# EAGLE design SolarPanel 2p2AZ1 (EAGLE 7.6.0)

## Sheet 1 of 6
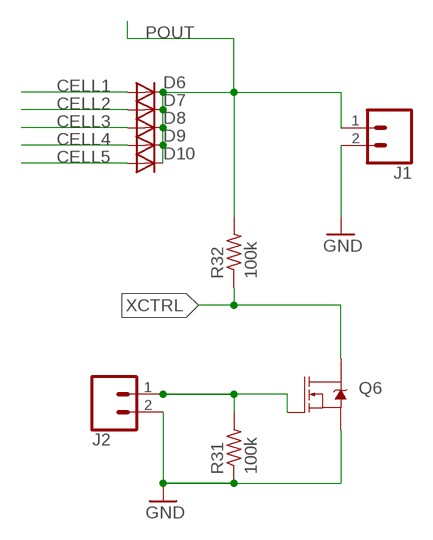
[diagram p0: schematic, sheet 1]

### Parts
D6  DIODE-SOD123  [SOD123]
D7  DIODE-SOD123  [SOD123]
D8  DIODE-SOD123  [SOD123]
D9  DIODE-SOD123  [SOD123]
D10  DIODE-SOD123  [SOD123]
J1  CONN_02  [1X02]
J2  CONN_02  [1X02]
Q6  MOSFET-NCH-BSS138  [SOT23-3]
R31  100k  R-US_R0603  [R0603]
R32  100k  R-US_R0603  [R0603]

### Nets
CELL1: D6.A ; also sheet 2
CELL2: D7.A ; also sheet 3
CELL3: D8.A ; also sheet 4
CELL4: D9.A ; also sheet 5
CELL5: D10.A ; also sheet 6
GND: J1.2 J2.2 Q6.2(S) R31.1 ; also sheet 2,3,4,5,6
N$4: J2.1 Q6.1(G) R31.2
POUT: D6.C D7.C D8.C D9.C D10.C J1.1 R32.2
XCTRL: Q6.3(D) R32.1 ; also sheet 2,3,4,5,6

## Sheet 2 of 6
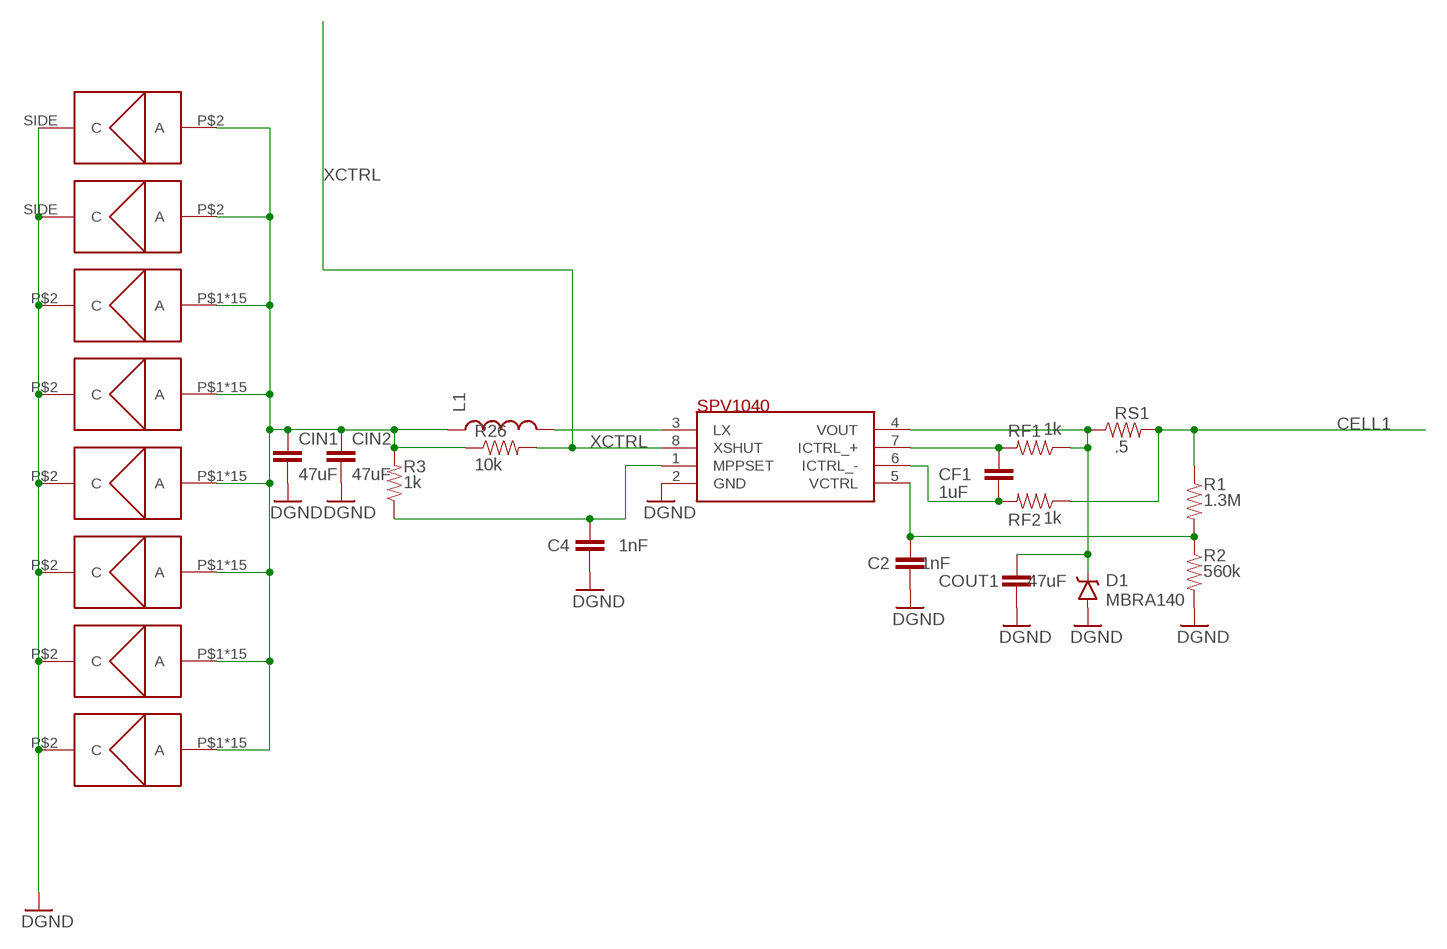
[diagram p1: schematic, sheet 2]

### Parts
C2  1nF  CAP0603-CAP  [0603-CAP]
C4  1nF  CAP0603-CAP  [0603-CAP]
CF1  1uF  CAP0603-CAP  [0603-CAP]
CIN1  47uF  CAP1206  [1206]
CIN2  47uF  CAP1206  [1206]
COUT1  47uF  CAP1206  [1206]
D1  MBRA140  DIODE-SCHOTTKY-MBRA140  [SMA-DIODE]
L1  INDUCTOR1210  [1210]
R1  1.3M  RESISTOR0603-RES  [0603-RES]
R2  560k  RESISTOR0603-RES  [0603-RES]
R3  1k  RESISTOR0603-RES  [0603-RES]
R26  10k  RESISTOR0603-RES  [0603-RES]
RF1  1k  RESISTOR0603-RES  [0603-RES]
RF2  1k  RESISTOR0603-RES  [0603-RES]
RS1  .5  RESISTOR0603-RES  [0603-RES]
U$11  TASC_VIA  [TASC_VIA]
U$12  TASC_VIA  [TASC_VIA]
U$13  TASC_VIA  [TASC_VIA]
U$14  TASC_VIA  [TASC_VIA]
U$15  SPV1040  [TSSOP8]
U$16  TASC_VIA  [TASC_VIA]
U$17  TASC_VIA  [TASC_VIA]
U$18  TASC  [TASC]
U$19  TASC  [TASC]

### Nets
CELL1: R1.1 RF2.1 RS1.2 ; also sheet 1
GND: C2.2 C4.2 CIN1.2 CIN2.2 COUT1.2 D1.A R2.2 U$11.P$2(C) U$12.P$2(C) U$13.P$2(C) U$14.P$2(C) U$15.2(GND) U$16.P$2(C) U$17.P$2(C) U$18.SIDE(C) U$19.SIDE(C) ; supply symbol labelled DGND ; also sheet 1,3,4,5,6
N$3: CIN1.1 CIN2.1 L1.1 R3.2 R26.1 U$11.P$1(A) U$11.P$3(A) U$11.P$4(A) U$11.P$5(A) U$11.P$6(A) U$11.P$7(A) U$11.P$8(A) U$11.P$9(A) U$11.P$10(A) U$11.P$11(A) U$11.P$12(A) U$11.P$13(A) U$11.P$14(A) U$11.P$15(A) U$11.P$16(A) U$12.P$1(A) U$12.P$3(A) U$12.P$4(A) U$12.P$5(A) U$12.P$6(A) U$12.P$7(A) U$12.P$8(A) U$12.P$9(A) U$12.P$10(A) U$12.P$11(A) U$12.P$12(A) U$12.P$13(A) U$12.P$14(A) U$12.P$15(A) U$12.P$16(A) U$13.P$1(A) U$13.P$3(A) U$13.P$4(A) U$13.P$5(A) U$13.P$6(A) U$13.P$7(A) U$13.P$8(A) U$13.P$9(A) U$13.P$10(A) U$13.P$11(A) U$13.P$12(A) U$13.P$13(A) U$13.P$14(A) U$13.P$15(A) U$13.P$16(A) U$14.P$1(A) U$14.P$3(A) U$14.P$4(A) U$14.P$5(A) U$14.P$6(A) U$14.P$7(A) U$14.P$8(A) U$14.P$9(A) U$14.P$10(A) U$14.P$11(A) U$14.P$12(A) U$14.P$13(A) U$14.P$14(A) U$14.P$15(A) U$14.P$16(A) U$16.P$1(A) U$16.P$3(A) U$16.P$4(A) U$16.P$5(A) U$16.P$6(A) U$16.P$7(A) U$16.P$8(A) U$16.P$9(A) U$16.P$10(A) U$16.P$11(A) U$16.P$12(A) U$16.P$13(A) U$16.P$14(A) U$16.P$15(A) U$16.P$16(A) U$17.P$1(A) U$17.P$3(A) U$17.P$4(A) U$17.P$5(A) U$17.P$6(A) U$17.P$7(A) U$17.P$8(A) U$17.P$9(A) U$17.P$10(A) U$17.P$11(A) U$17.P$12(A) U$17.P$13(A) U$17.P$14(A) U$17.P$15(A) U$17.P$16(A) U$18.P$2(A) U$19.P$2(A)
N$11: C2.1 R1.2 R2.1 U$15.5(VCTRL)
N$12: CF1.1 RF1.2 U$15.7(ICTRL_+)
N$13: CF1.2 RF2.2 U$15.6(ICTRL_-)
N$14: COUT1.1 D1.C RF1.1 RS1.1 U$15.4(VOUT)
N$15: L1.2 U$15.3(LX)
N$43: C4.1 R3.1 U$15.1(MPPSET)
XCTRL: R26.2 U$15.8(XSHUT) ; also sheet 1,3,4,5,6

## Sheet 3 of 6
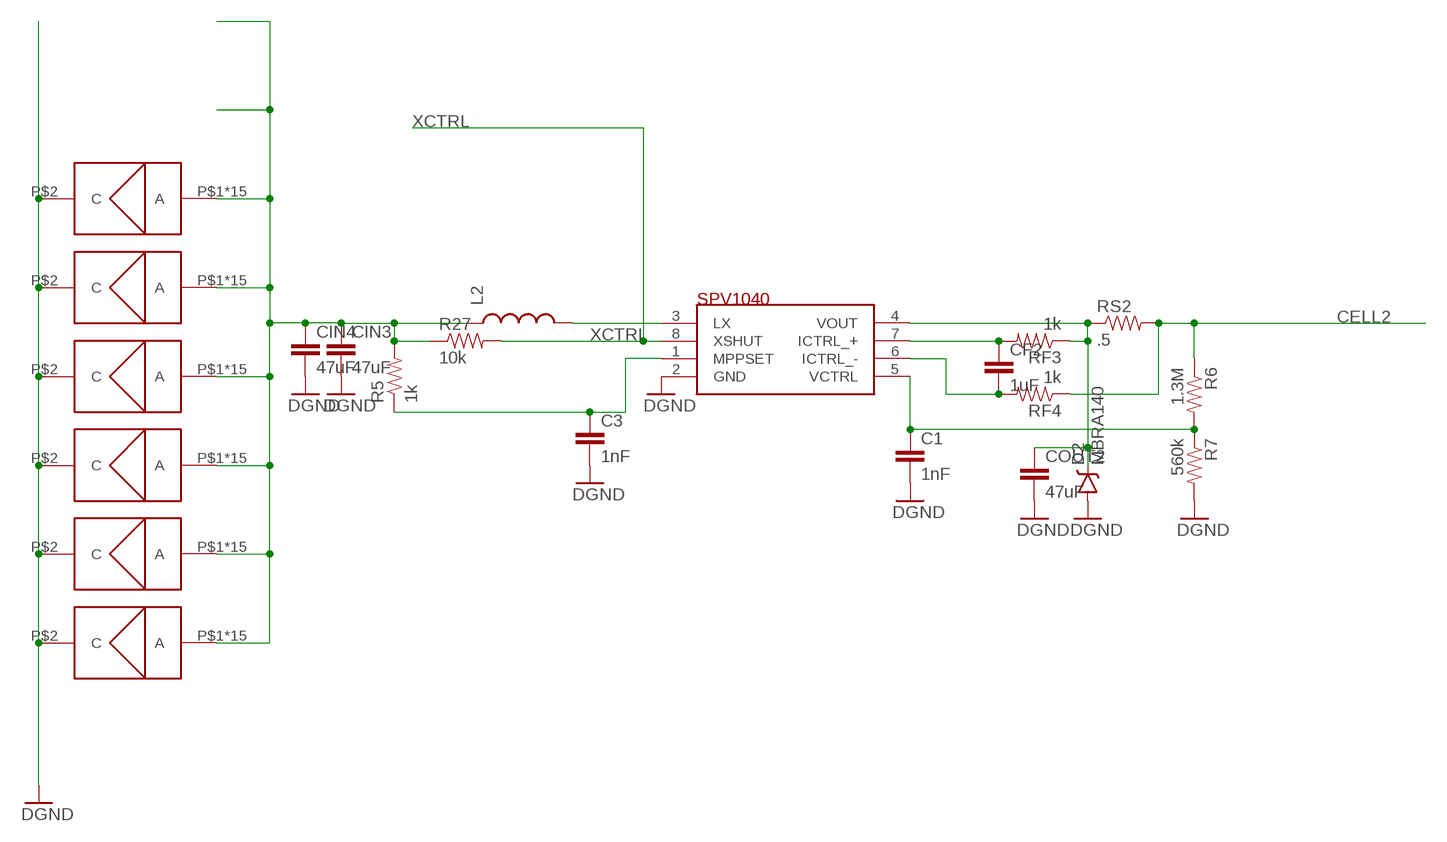
[diagram p2: schematic, sheet 3]

### Parts
C1  1nF  CAP0603-CAP  [0603-CAP]
C3  1nF  CAP0603-CAP  [0603-CAP]
CF2  1uF  CAP0603-CAP  [0603-CAP]
CIN3  47uF  CAP1206  [1206]
CIN4  47uF  CAP1206  [1206]
COUT2  47uF  CAP1206  [1206]
D2  MBRA140  DIODE-SCHOTTKY-MBRA140  [SMA-DIODE]
L2  INDUCTOR1210  [1210]
R5  1k  RESISTOR0603-RES  [0603-RES]
R6  1.3M  RESISTOR0603-RES  [0603-RES]
R7  560k  RESISTOR0603-RES  [0603-RES]
R27  10k  RESISTOR0603-RES  [0603-RES]
RF3  1k  RESISTOR0603-RES  [0603-RES]
RF4  1k  RESISTOR0603-RES  [0603-RES]
RS2  .5  RESISTOR0603-RES  [0603-RES]
U$1  TASC_VIA  [TASC_VIA]
U$2  TASC_VIA  [TASC_VIA]
U$3  TASC_VIA  [TASC_VIA]
U$4  TASC_VIA  [TASC_VIA]
U$5  SPV1040  [TSSOP8]
U$6  TASC_VIA  [TASC_VIA]
U$7  TASC_VIA  [TASC_VIA]

### Nets
CELL2: R6.1 RF4.1 RS2.2 ; also sheet 1
GND: C1.2 C3.2 CIN3.2 CIN4.2 COUT2.2 D2.A R7.2 U$1.P$2(C) U$2.P$2(C) U$3.P$2(C) U$4.P$2(C) U$5.2(GND) U$6.P$2(C) U$7.P$2(C) ; supply symbol labelled DGND ; also sheet 1,2,4,5,6
N$5: CIN3.1 CIN4.1 L2.1 R5.2 R27.1 U$1.P$1(A) U$1.P$3(A) U$1.P$4(A) U$1.P$5(A) U$1.P$6(A) U$1.P$7(A) U$1.P$8(A) U$1.P$9(A) U$1.P$10(A) U$1.P$11(A) U$1.P$12(A) U$1.P$13(A) U$1.P$14(A) U$1.P$15(A) U$1.P$16(A) U$2.P$1(A) U$2.P$3(A) U$2.P$4(A) U$2.P$5(A) U$2.P$6(A) U$2.P$7(A) U$2.P$8(A) U$2.P$9(A) U$2.P$10(A) U$2.P$11(A) U$2.P$12(A) U$2.P$13(A) U$2.P$14(A) U$2.P$15(A) U$2.P$16(A) U$3.P$1(A) U$3.P$3(A) U$3.P$4(A) U$3.P$5(A) U$3.P$6(A) U$3.P$7(A) U$3.P$8(A) U$3.P$9(A) U$3.P$10(A) U$3.P$11(A) U$3.P$12(A) U$3.P$13(A) U$3.P$14(A) U$3.P$15(A) U$3.P$16(A) U$4.P$1(A) U$4.P$3(A) U$4.P$4(A) U$4.P$5(A) U$4.P$6(A) U$4.P$7(A) U$4.P$8(A) U$4.P$9(A) U$4.P$10(A) U$4.P$11(A) U$4.P$12(A) U$4.P$13(A) U$4.P$14(A) U$4.P$15(A) U$4.P$16(A) U$6.P$1(A) U$6.P$3(A) U$6.P$4(A) U$6.P$5(A) U$6.P$6(A) U$6.P$7(A) U$6.P$8(A) U$6.P$9(A) U$6.P$10(A) U$6.P$11(A) U$6.P$12(A) U$6.P$13(A) U$6.P$14(A) U$6.P$15(A) U$6.P$16(A) U$7.P$1(A) U$7.P$3(A) U$7.P$4(A) U$7.P$5(A) U$7.P$6(A) U$7.P$7(A) U$7.P$8(A) U$7.P$9(A) U$7.P$10(A) U$7.P$11(A) U$7.P$12(A) U$7.P$13(A) U$7.P$14(A) U$7.P$15(A) U$7.P$16(A)
N$6: C3.1 R5.1 U$5.1(MPPSET)
N$7: C1.1 R6.2 R7.1 U$5.5(VCTRL)
N$8: CF2.1 RF3.2 U$5.7(ICTRL_+)
N$9: CF2.2 RF4.2 U$5.6(ICTRL_-)
N$10: COUT2.1 D2.C RF3.1 RS2.1 U$5.4(VOUT)
N$16: L2.2 U$5.3(LX)
XCTRL: R27.2 U$5.8(XSHUT) ; also sheet 1,2,4,5,6

## Sheet 4 of 6
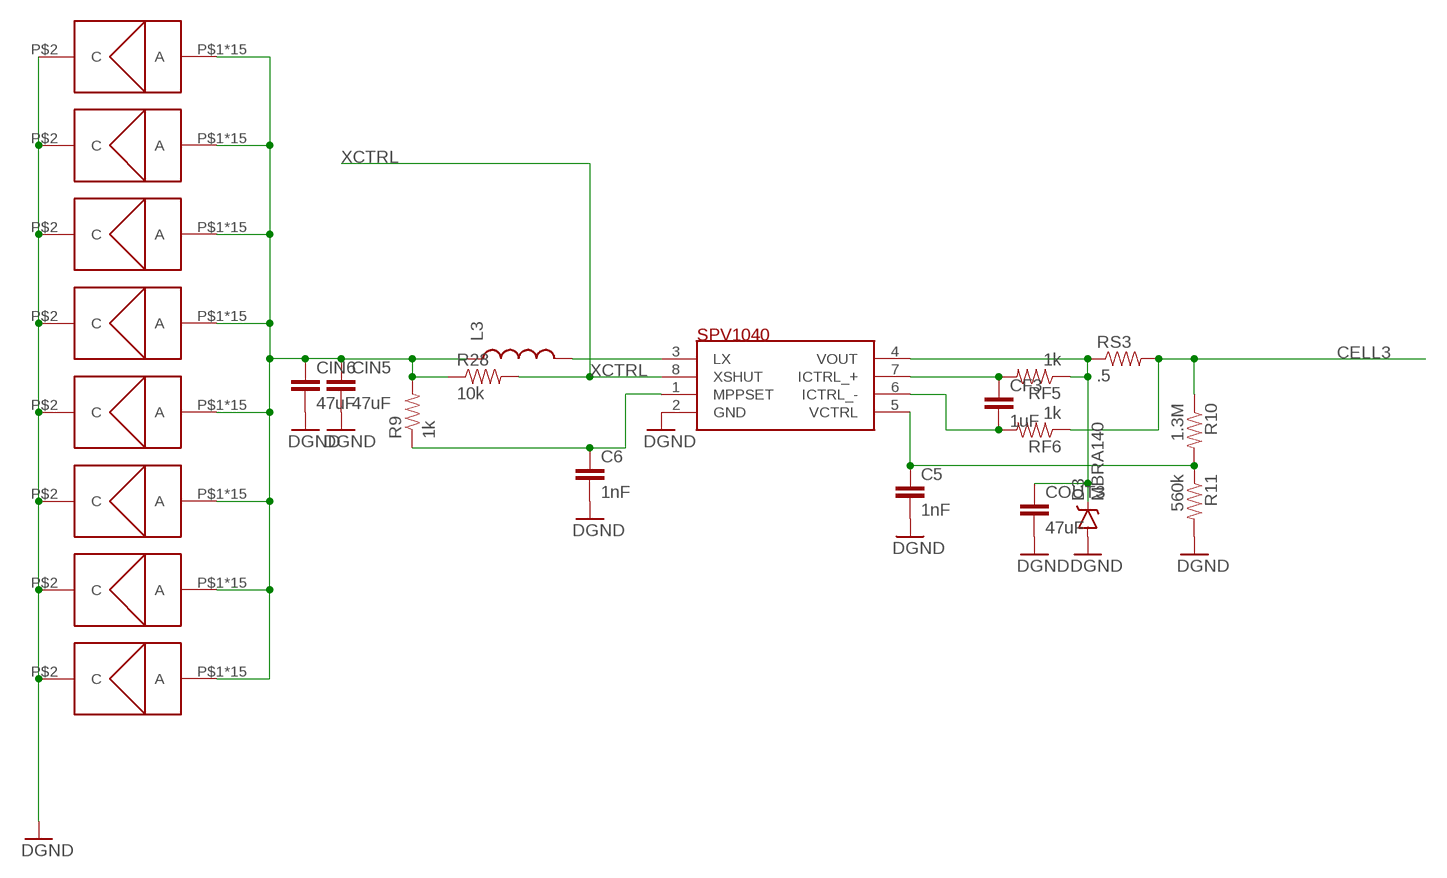
[diagram p3: schematic, sheet 4]

### Parts
C5  1nF  CAP0603-CAP  [0603-CAP]
C6  1nF  CAP0603-CAP  [0603-CAP]
CF3  1uF  CAP0603-CAP  [0603-CAP]
CIN5  47uF  CAP1206  [1206]
CIN6  47uF  CAP1206  [1206]
COUT3  47uF  CAP1206  [1206]
D3  MBRA140  DIODE-SCHOTTKY-MBRA140  [SMA-DIODE]
L3  INDUCTOR1210  [1210]
R9  1k  RESISTOR0603-RES  [0603-RES]
R10  1.3M  RESISTOR0603-RES  [0603-RES]
R11  560k  RESISTOR0603-RES  [0603-RES]
R28  10k  RESISTOR0603-RES  [0603-RES]
RF5  1k  RESISTOR0603-RES  [0603-RES]
RF6  1k  RESISTOR0603-RES  [0603-RES]
RS3  .5  RESISTOR0603-RES  [0603-RES]
U$21  TASC_VIA  [TASC_VIA]
U$22  TASC_VIA  [TASC_VIA]
U$23  TASC_VIA  [TASC_VIA]
U$24  TASC_VIA  [TASC_VIA]
U$25  SPV1040  [TSSOP8]
U$26  TASC_VIA  [TASC_VIA]
U$27  TASC_VIA  [TASC_VIA]
U$28  TASC_VIA  [TASC_VIA]
U$29  TASC_VIA  [TASC_VIA]

### Nets
CELL3: R10.1 RF6.1 RS3.2 ; also sheet 1
GND: C5.2 C6.2 CIN5.2 CIN6.2 COUT3.2 D3.A R11.2 U$21.P$2(C) U$22.P$2(C) U$23.P$2(C) U$24.P$2(C) U$25.2(GND) U$26.P$2(C) U$27.P$2(C) U$28.P$2(C) U$29.P$2(C) ; supply symbol labelled DGND ; also sheet 1,2,3,5,6
N$18: CIN5.1 CIN6.1 L3.1 R9.2 R28.1 U$21.P$1(A) U$21.P$3(A) U$21.P$4(A) U$21.P$5(A) U$21.P$6(A) U$21.P$7(A) U$21.P$8(A) U$21.P$9(A) U$21.P$10(A) U$21.P$11(A) U$21.P$12(A) U$21.P$13(A) U$21.P$14(A) U$21.P$15(A) U$21.P$16(A) U$22.P$1(A) U$22.P$3(A) U$22.P$4(A) U$22.P$5(A) U$22.P$6(A) U$22.P$7(A) U$22.P$8(A) U$22.P$9(A) U$22.P$10(A) U$22.P$11(A) U$22.P$12(A) U$22.P$13(A) U$22.P$14(A) U$22.P$15(A) U$22.P$16(A) U$23.P$1(A) U$23.P$3(A) U$23.P$4(A) U$23.P$5(A) U$23.P$6(A) U$23.P$7(A) U$23.P$8(A) U$23.P$9(A) U$23.P$10(A) U$23.P$11(A) U$23.P$12(A) U$23.P$13(A) U$23.P$14(A) U$23.P$15(A) U$23.P$16(A) U$24.P$1(A) U$24.P$3(A) U$24.P$4(A) U$24.P$5(A) U$24.P$6(A) U$24.P$7(A) U$24.P$8(A) U$24.P$9(A) U$24.P$10(A) U$24.P$11(A) U$24.P$12(A) U$24.P$13(A) U$24.P$14(A) U$24.P$15(A) U$24.P$16(A) U$26.P$1(A) U$26.P$3(A) U$26.P$4(A) U$26.P$5(A) U$26.P$6(A) U$26.P$7(A) U$26.P$8(A) U$26.P$9(A) U$26.P$10(A) U$26.P$11(A) U$26.P$12(A) U$26.P$13(A) U$26.P$14(A) U$26.P$15(A) U$26.P$16(A) U$27.P$1(A) U$27.P$3(A) U$27.P$4(A) U$27.P$5(A) U$27.P$6(A) U$27.P$7(A) U$27.P$8(A) U$27.P$9(A) U$27.P$10(A) U$27.P$11(A) U$27.P$12(A) U$27.P$13(A) U$27.P$14(A) U$27.P$15(A) U$27.P$16(A) U$28.P$1(A) U$28.P$3(A) U$28.P$4(A) U$28.P$5(A) U$28.P$6(A) U$28.P$7(A) U$28.P$8(A) U$28.P$9(A) U$28.P$10(A) U$28.P$11(A) U$28.P$12(A) U$28.P$13(A) U$28.P$14(A) U$28.P$15(A) U$28.P$16(A) U$29.P$1(A) U$29.P$3(A) U$29.P$4(A) U$29.P$5(A) U$29.P$6(A) U$29.P$7(A) U$29.P$8(A) U$29.P$9(A) U$29.P$10(A) U$29.P$11(A) U$29.P$12(A) U$29.P$13(A) U$29.P$14(A) U$29.P$15(A) U$29.P$16(A)
N$19: C6.1 R9.1 U$25.1(MPPSET)
N$20: C5.1 R10.2 R11.1 U$25.5(VCTRL)
N$21: CF3.1 RF5.2 U$25.7(ICTRL_+)
N$22: CF3.2 RF6.2 U$25.6(ICTRL_-)
N$23: COUT3.1 D3.C RF5.1 RS3.1 U$25.4(VOUT)
N$24: L3.2 U$25.3(LX)
XCTRL: R28.2 U$25.8(XSHUT) ; also sheet 1,2,3,5,6

## Sheet 5 of 6
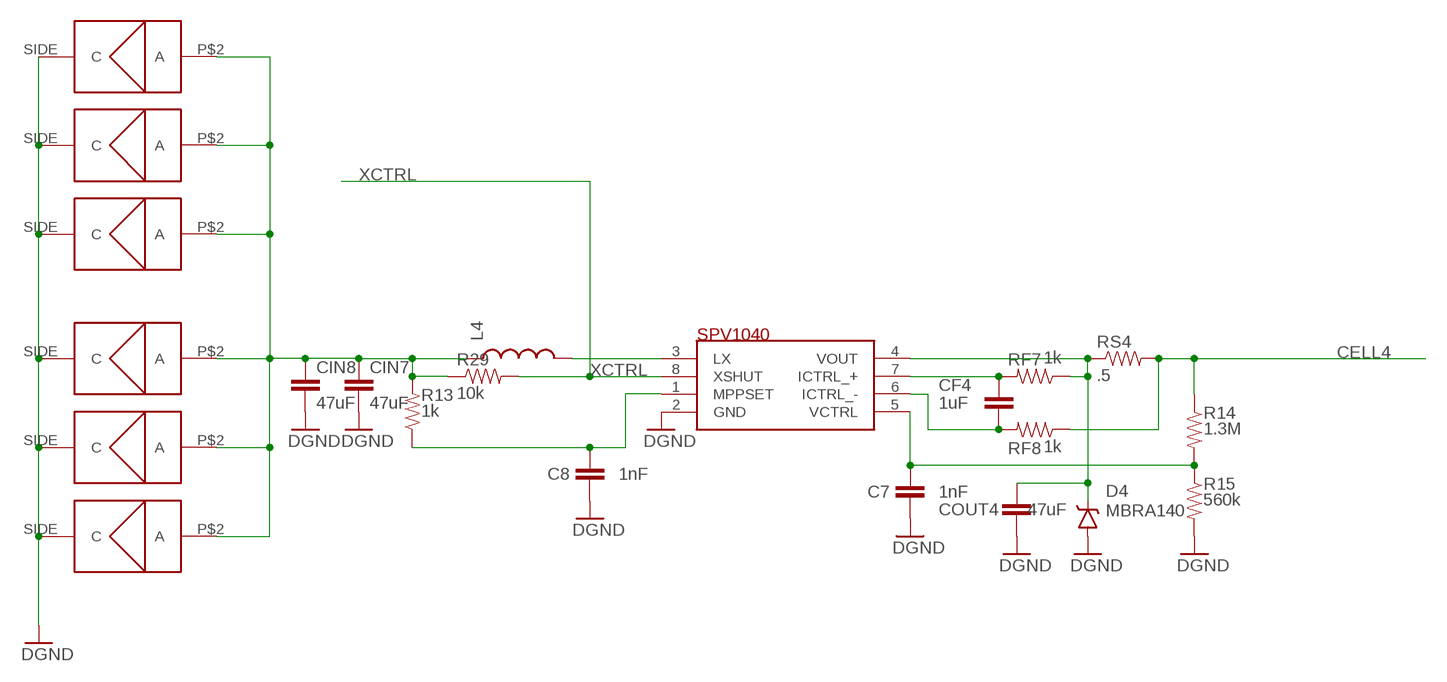
[diagram p4: schematic, sheet 5]

### Parts
C7  1nF  CAP0603-CAP  [0603-CAP]
C8  1nF  CAP0603-CAP  [0603-CAP]
CF4  1uF  CAP0603-CAP  [0603-CAP]
CIN7  47uF  CAP1206  [1206]
CIN8  47uF  CAP1206  [1206]
COUT4  47uF  CAP1206  [1206]
D4  MBRA140  DIODE-SCHOTTKY-MBRA140  [SMA-DIODE]
L4  INDUCTOR1210  [1210]
R13  1k  RESISTOR0603-RES  [0603-RES]
R14  1.3M  RESISTOR0603-RES  [0603-RES]
R15  560k  RESISTOR0603-RES  [0603-RES]
R29  10k  RESISTOR0603-RES  [0603-RES]
RF7  1k  RESISTOR0603-RES  [0603-RES]
RF8  1k  RESISTOR0603-RES  [0603-RES]
RS4  .5  RESISTOR0603-RES  [0603-RES]
U$33  TASC  [TASC]
U$34  TASC  [TASC]
U$35  SPV1040  [TSSOP8]
U$36  TASC  [TASC]
U$37  TASC  [TASC]
U$38  TASC  [TASC]
U$39  TASC  [TASC]

### Nets
CELL4: R14.1 RF8.1 RS4.2 ; also sheet 1
GND: C7.2 C8.2 CIN7.2 CIN8.2 COUT4.2 D4.A R15.2 U$33.SIDE(C) U$34.SIDE(C) U$35.2(GND) U$36.SIDE(C) U$37.SIDE(C) U$38.SIDE(C) U$39.SIDE(C) ; supply symbol labelled DGND ; also sheet 1,2,3,4,6
N$26: CIN7.1 CIN8.1 L4.1 R13.2 R29.1 U$33.P$2(A) U$34.P$2(A) U$36.P$2(A) U$37.P$2(A) U$38.P$2(A) U$39.P$2(A)
N$27: C8.1 R13.1 U$35.1(MPPSET)
N$28: C7.1 R14.2 R15.1 U$35.5(VCTRL)
N$29: CF4.1 RF7.2 U$35.7(ICTRL_+)
N$30: CF4.2 RF8.2 U$35.6(ICTRL_-)
N$31: COUT4.1 D4.C RF7.1 RS4.1 U$35.4(VOUT)
N$32: L4.2 U$35.3(LX)
XCTRL: R29.2 U$35.8(XSHUT) ; also sheet 1,2,3,4,6

## Sheet 6 of 6
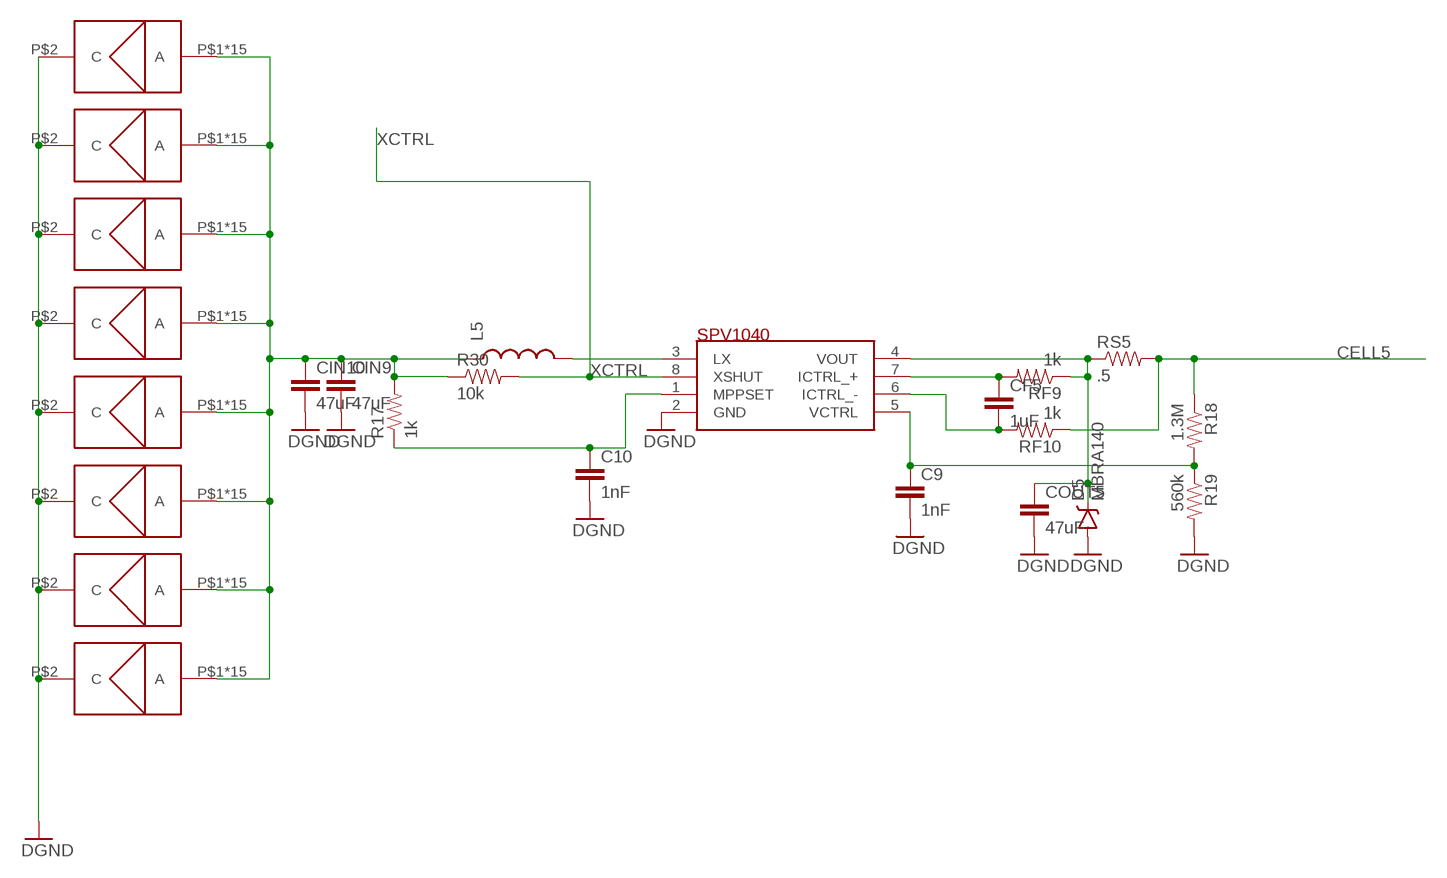
[diagram p5: schematic, sheet 6]

### Parts
C9  1nF  CAP0603-CAP  [0603-CAP]
C10  1nF  CAP0603-CAP  [0603-CAP]
CF5  1uF  CAP0603-CAP  [0603-CAP]
CIN9  47uF  CAP1206  [1206]
CIN10  47uF  CAP1206  [1206]
COUT5  47uF  CAP1206  [1206]
D5  MBRA140  DIODE-SCHOTTKY-MBRA140  [SMA-DIODE]
L5  INDUCTOR1210  [1210]
R17  1k  RESISTOR0603-RES  [0603-RES]
R18  1.3M  RESISTOR0603-RES  [0603-RES]
R19  560k  RESISTOR0603-RES  [0603-RES]
R30  10k  RESISTOR0603-RES  [0603-RES]
RF9  1k  RESISTOR0603-RES  [0603-RES]
RF10  1k  RESISTOR0603-RES  [0603-RES]
RS5  .5  RESISTOR0603-RES  [0603-RES]
U$41  TASC_VIA  [TASC_VIA]
U$42  TASC_VIA  [TASC_VIA]
U$43  TASC_VIA  [TASC_VIA]
U$44  TASC_VIA  [TASC_VIA]
U$45  SPV1040  [TSSOP8]
U$46  TASC_VIA  [TASC_VIA]
U$47  TASC_VIA  [TASC_VIA]
U$48  TASC_VIA  [TASC_VIA]
U$49  TASC_VIA  [TASC_VIA]

### Nets
CELL5: R18.1 RF10.1 RS5.2 ; also sheet 1
GND: C9.2 C10.2 CIN9.2 CIN10.2 COUT5.2 D5.A R19.2 U$41.P$2(C) U$42.P$2(C) U$43.P$2(C) U$44.P$2(C) U$45.2(GND) U$46.P$2(C) U$47.P$2(C) U$48.P$2(C) U$49.P$2(C) ; supply symbol labelled DGND ; also sheet 1,2,3,4,5
N$34: CIN9.1 CIN10.1 L5.1 R17.2 R30.1 U$41.P$1(A) U$41.P$3(A) U$41.P$4(A) U$41.P$5(A) U$41.P$6(A) U$41.P$7(A) U$41.P$8(A) U$41.P$9(A) U$41.P$10(A) U$41.P$11(A) U$41.P$12(A) U$41.P$13(A) U$41.P$14(A) U$41.P$15(A) U$41.P$16(A) U$42.P$1(A) U$42.P$3(A) U$42.P$4(A) U$42.P$5(A) U$42.P$6(A) U$42.P$7(A) U$42.P$8(A) U$42.P$9(A) U$42.P$10(A) U$42.P$11(A) U$42.P$12(A) U$42.P$13(A) U$42.P$14(A) U$42.P$15(A) U$42.P$16(A) U$43.P$1(A) U$43.P$3(A) U$43.P$4(A) U$43.P$5(A) U$43.P$6(A) U$43.P$7(A) U$43.P$8(A) U$43.P$9(A) U$43.P$10(A) U$43.P$11(A) U$43.P$12(A) U$43.P$13(A) U$43.P$14(A) U$43.P$15(A) U$43.P$16(A) U$44.P$1(A) U$44.P$3(A) U$44.P$4(A) U$44.P$5(A) U$44.P$6(A) U$44.P$7(A) U$44.P$8(A) U$44.P$9(A) U$44.P$10(A) U$44.P$11(A) U$44.P$12(A) U$44.P$13(A) U$44.P$14(A) U$44.P$15(A) U$44.P$16(A) U$46.P$1(A) U$46.P$3(A) U$46.P$4(A) U$46.P$5(A) U$46.P$6(A) U$46.P$7(A) U$46.P$8(A) U$46.P$9(A) U$46.P$10(A) U$46.P$11(A) U$46.P$12(A) U$46.P$13(A) U$46.P$14(A) U$46.P$15(A) U$46.P$16(A) U$47.P$1(A) U$47.P$3(A) U$47.P$4(A) U$47.P$5(A) U$47.P$6(A) U$47.P$7(A) U$47.P$8(A) U$47.P$9(A) U$47.P$10(A) U$47.P$11(A) U$47.P$12(A) U$47.P$13(A) U$47.P$14(A) U$47.P$15(A) U$47.P$16(A) U$48.P$1(A) U$48.P$3(A) U$48.P$4(A) U$48.P$5(A) U$48.P$6(A) U$48.P$7(A) U$48.P$8(A) U$48.P$9(A) U$48.P$10(A) U$48.P$11(A) U$48.P$12(A) U$48.P$13(A) U$48.P$14(A) U$48.P$15(A) U$48.P$16(A) U$49.P$1(A) U$49.P$3(A) U$49.P$4(A) U$49.P$5(A) U$49.P$6(A) U$49.P$7(A) U$49.P$8(A) U$49.P$9(A) U$49.P$10(A) U$49.P$11(A) U$49.P$12(A) U$49.P$13(A) U$49.P$14(A) U$49.P$15(A) U$49.P$16(A)
N$35: C10.1 R17.1 U$45.1(MPPSET)
N$36: C9.1 R18.2 R19.1 U$45.5(VCTRL)
N$37: CF5.1 RF9.2 U$45.7(ICTRL_+)
N$38: CF5.2 RF10.2 U$45.6(ICTRL_-)
N$39: COUT5.1 D5.C RF9.1 RS5.1 U$45.4(VOUT)
N$40: L5.2 U$45.3(LX)
XCTRL: R30.2 U$45.8(XSHUT) ; also sheet 1,2,3,4,5

## Library data of the parts
C1-C10 CF1-CF5 CIN1-CIN10 COUT1-COUT5 = SparkFun-Passives:CAP: Capacitor Standard 0603 ceramic capacitor, and 0.1" leaded capacitor.
D1-D5 = SparkFun-DiscreteSemi:DIODE-SCHOTTKY: Schottky diodes in SFE's production catalog BAT20J 1A 23V 0.62Vf RB751 120mA 40V 0.37Vf PMEG4005EJ 0.5A 40V 0.42Vf MBRA140 1A 40V 0.5Vf B340A 3A 40V SMA; PROD_ID: DIO-08053
D6-D10 = diode:DIODE-: DIODE
J1 J2 = SparkFun-Connectors:CONN_02: Multi connection point. Often used as Generic Header-pin footprint for 0.1 inch spaced/style header connections On any of the 0.1 inch spaced packages, you can populate with these: Break Away Headers - Straight <https://www.sparkfun.com/products/116> (PRT-00116) Break Away Male Headers - Right Angle <https://www.sparkfun.com/products/553> (PRT-00553) Female Headers <https://www.sparkfun.com/products/115> (PRT-00115) Break Away Headers - Machine Pin <https://www.sparkfun.com/products/117> (PRT-00117) Break Away Female Headers - Swiss Machine Pin <https://www.sparkfun.com/products/743> (PRT-00743) For SCREWTERMINALS and SPRING TERMINALS visit here: Screw Terimnals on SparkFun.com <https://www.sparkfun.com/search/results?term=Screw+Terminals> (5mm/3.5mm/2.54mm spacing) This device is also useful as a general connection point to wire up your design to another part of your project. Our various solder wires solder well into these plated through hole pads. Hook-Up Wire - Assortment (Stranded, 22 AWG) <https://www.sparkfun.com/products/11375> (PRT-11375) Hook-Up Wire - Assortment (Solid Core, 22 AWG) <https://www.sparkfun.com/products/11367> (PRT-11367) View the entire wire category on our website here <https://www.sparkfun.com/categories/141> Special notes: Molex polarized connector foot print use with: PRT-08233 with associated crimp pins and housings. 2.54_SCREWTERM for use with PRT-10571. 3.5mm Screw Terminal footprints for PRT-08084 5mm Screw Terminal footprints for use with PRT-08432
L1-L5 = SparkFun-Passives:INDUCTOR: Inductors Basic Inductor/Choke - 0603 and 1206. Footprints are not proven and vary greatly between part numbers. INDUCTOR POWER 3.3UH 4.0A SMD 0.197" L x 0.197" W x 0.177" H (5.00mm x 5.00mm x 4.50mm)
Q6 = SparkFun-DiscreteSemi:MOSFET-NCH: N-channel MOSFETs Voltage controlled devices that allow control of high current outputs. SparkFun Products: SparkFun OpenScale <https://www.sparkfun.com/products/13261> SparkFun Digital Sandbox <https://www.sparkfun.com/products/12651> SparkFun Monster Moto Shield <https://www.sparkfun.com/products/10182> SparkFun MOSFET Power Controller <https://www.sparkfun.com/products/11214>; PROD_ID: TRANS-00830; VALUE: 220mA/50V/3.5Ω
R1-R3 R5-R7 R9-R11 R13-R15 R17-R19 R26-R30 RF1-RF10 RS1-RS5 = SparkFun-Passives:RESISTOR: Resistor Basic schematic elements and footprints for 0603, 1206, and PTH resistors.
R31 R32 = resistor:R-US_: RESISTOR, American symbol
U$1-U$4 U$6 U$7 U$11-U$14 U$16 U$17 U$21-U$24 U$26-U$29 U$41-U$44 U$46-U$49 = Solar:TASC_VIA
U$5 U$15 U$25 U$35 U$45 = Solar:SPV1040
U$18 U$19 U$33 U$34 U$36-U$39 = Solar:TASC

## Board
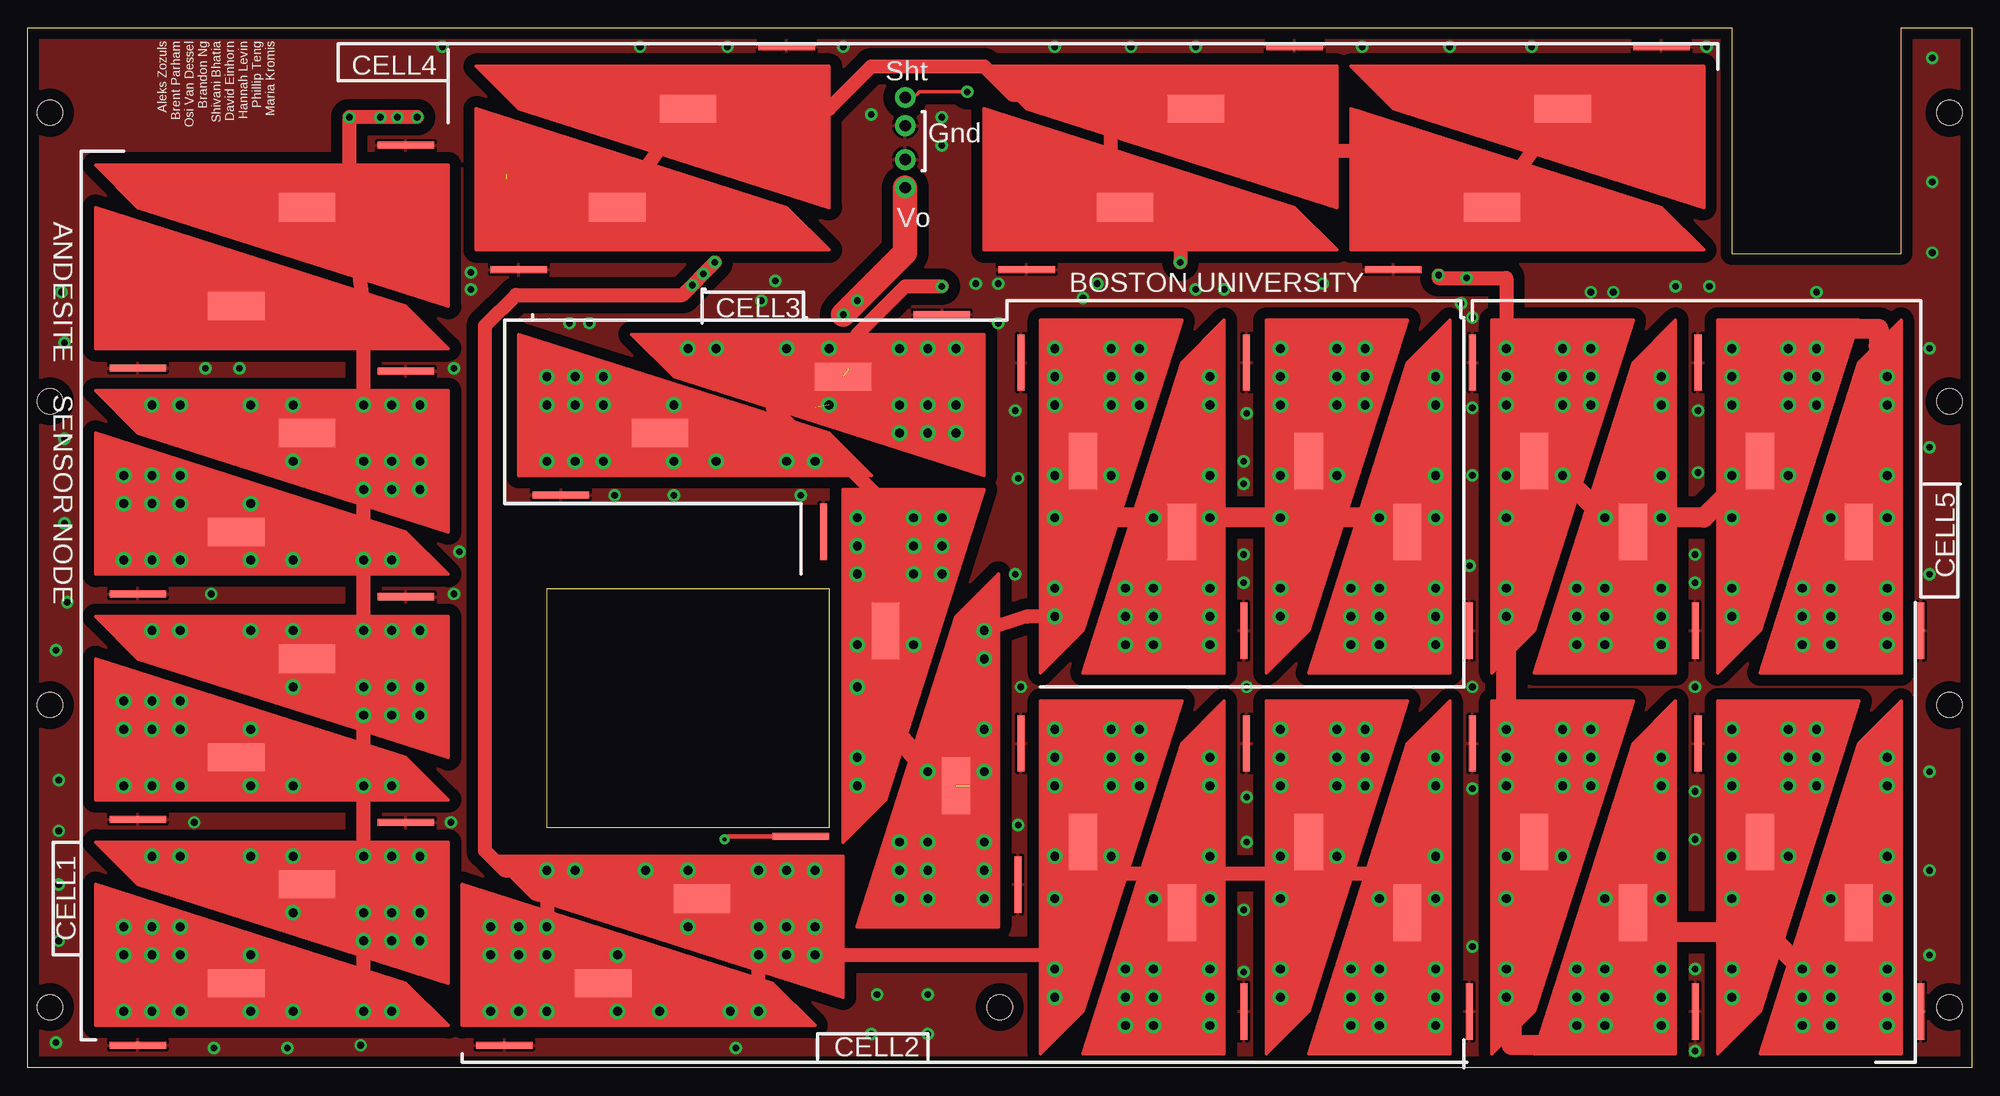
[diagram p6: board, top side]
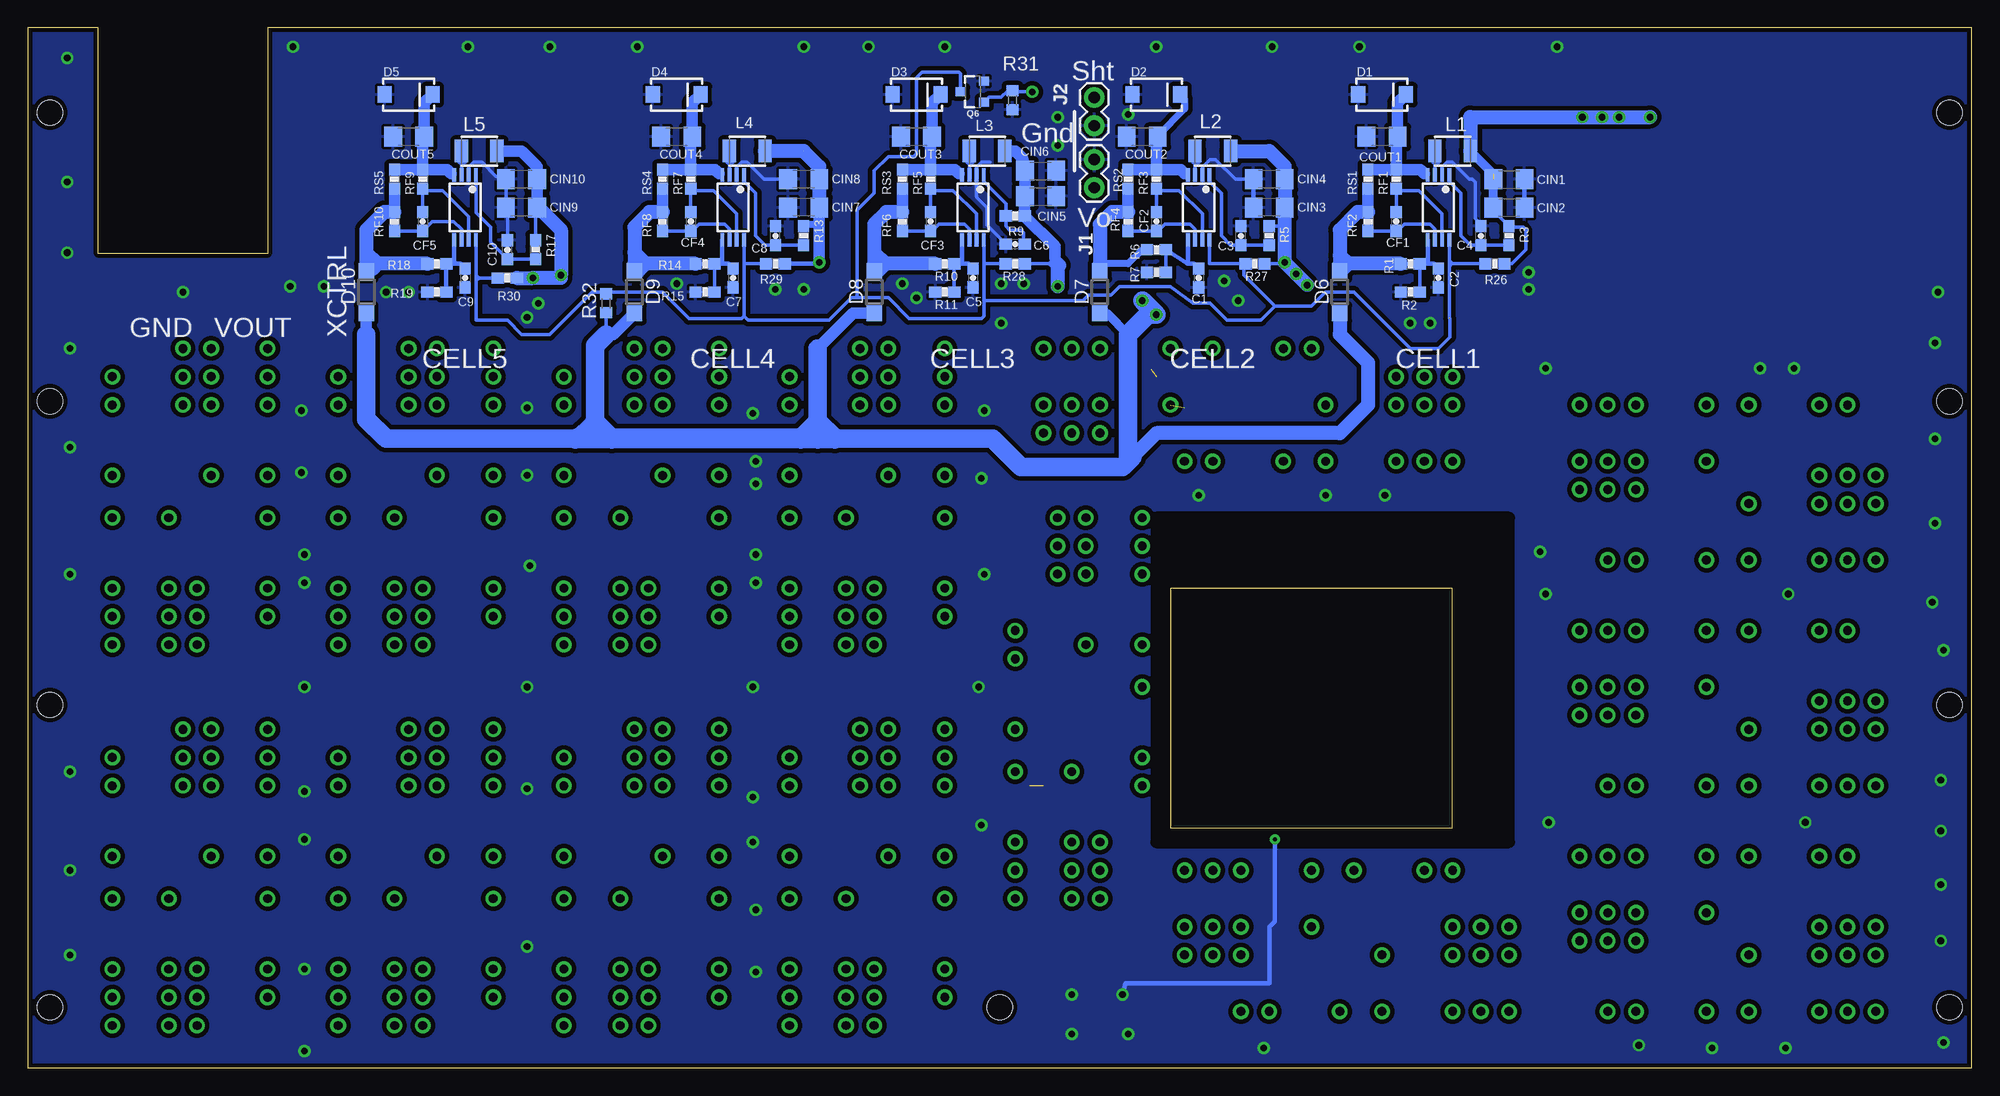
[diagram p7: board, bottom side, seen from below]

Size 175.01 x 93.65 mm. Coordinates in mm from the lower left corner, seen from the top.
Outline: 175.01,0 0,0 0,93.65 153.42,93.65 153.42,73.33 168.66,73.33 168.66,93.65 175.01,93.65 175.01,0
Outline: 72.14,43.18 72.14,21.59 46.74,21.59 46.74,43.18 72.14,43.18
Copper layers (1*16): Top 0.035mm / dielectric 1.5mm / Bottom 0.035mm
Design rules "SparkFun *": minimum track width 8mil, minimum drill 20mil, track to track 8mil, track to pad 8mil, pad to pad 8mil, via to via 8mil, smd to smd 8mil, copper to edge 10mil, drill to drill 8mil, minimum pad ring 12mil, minimum via ring 10mil, stop-mask expansion 4mil, vias tented up to drill 25mil, thermal gap 10mil
Holes 2.26 mm at 173,5.46 173,86 2.01,5.46 2.01,86 87.5,5.46 173,32.66 173,60.02 2.01,60.02 2.01,32.66
tRestrict: area 41.7,20.3 to 73.4,49.5
bRestrict: area 41.7,20.3 to 73.4,49.5
Milling: 7 lines

### Footprints (pad centres in the part's own frame; a part is rotated, then mirrored left to right if it is on the bottom)
0603-CAP = smd 1.1 x 1: 1 -0.85,0; 2 0.85,0
1206 = smd 1.6 x 1.8: 1 -1.4,0; 2 1.4,0
SMA-DIODE = smd 1.27 x 1.47: A -2.15,0; C 2.15,0
SOD123 = smd 1.4 x 1.4: A 1.9,0; C -1.9,0
1X02 = drill 1.016 pad 1.88: 1 0,0; 2 2.54,0
1210 = smd 1.2 x 2: 1 -1.6,0; 2 1.6,0
SOT23-3 = smd 0.8 x 0.9: 1 -0.95,-1; 2 0.95,-1; 3 0,1.1
0603-RES = smd 1.1 x 1: 1 -0.85,0; 2 0.85,0
R0603 = smd 1 x 1.1: 1 -0.85,0; 2 0.85,0
TASC_VIA = smd 2.54 x 5.08: P$1 0,1.27 | smd 0.635 x 5.08: P$2 5.588,-7.62 | drill 0.8: P$3 2.54,-8.89; P$4 -2.54,-8.89; P$5 -5.08,-8.89; P$6 -5.08,-3.81; P$7 -2.54,-3.81; P$8 2.54,-3.81; P$9 2.54,2.54; P$10 -2.54,2.54; P$11 2.54,6.35; P$12 -5.08,-6.35; P$13 2.54,12.7; P$14 -2.54,-6.35; P$15 2.54,-6.35; P$16 2.54,15.24
TSSOP8 = smd 1.2 x 0.35: 1 -2.925,0.975; 2 -2.925,0.325; 3 -2.925,-0.325; 4 -2.925,-0.975; 5 2.925,-0.975; 6 2.925,-0.325; 7 2.925,0.325; 8 2.925,0.975
TASC = smd 2.54 x 5.08: P$2 0,1.27 | smd 0.635 x 5.08: SIDE 5.588,-7.62

### Placement (x,y rotation side)
C1  69.6,71.12 270 bottom
C2  48.01,71.12 270 bottom
C3  65.79,74.93 90 bottom
C4  44.2,74.93 90 bottom
C5  89.92,71.12 270 bottom
C6  86.11,74.17 180 bottom
C7  111.51,71.12 270 bottom
C8  107.7,74.93 90 bottom
C9  135.64,71.12 270 bottom
C10  131.83,73.66 90 bottom
CF1  51.82,76.2 270 bottom
CF2  73.41,76.2 270 bottom
CF3  93.73,76.2 270 bottom
CF4  115.32,76.2 270 bottom
CF5  139.45,76.2 270 bottom
CIN1  41.66,80.01 0 bottom
CIN2  41.66,77.47 0 bottom
CIN3  63.25,77.47 180 bottom
CIN4  63.25,80.01 180 bottom
CIN5  83.82,78.49 0 bottom
CIN6  83.82,80.77 0 bottom
CIN7  105.16,77.47 180 bottom
CIN8  105.16,80.01 180 bottom
CIN9  130.56,77.47 180 bottom
CIN10  130.56,80.01 180 bottom
COUT1  53.09,83.82 180 bottom
COUT2  74.68,83.82 180 bottom
COUT3  95,83.82 180 bottom
COUT4  116.59,83.82 180 bottom
COUT5  140.72,83.82 180 bottom
D1  53.09,87.63 0 bottom
D2  73.41,87.63 0 bottom
D3  95,87.63 0 bottom
D4  116.59,87.63 0 bottom
D5  140.72,87.63 0 bottom
D6  56.9,69.85 90 bottom
D7  78.49,69.85 90 bottom
D8  98.81,69.85 90 bottom
D9  120.4,69.85 90 bottom
D10  144.53,69.85 90 bottom
J1  78.99,79.25 90 bottom
J2  78.99,87.38 270 bottom
L1  46.74,82.55 180 bottom
L2  68.33,82.55 180 bottom
L3  88.65,82.55 180 bottom
L4  110.24,82.55 180 bottom
L5  134.37,82.55 180 bottom
Q6  89.92,87.88 90 bottom
R1  50.55,72.39 0 bottom
R2  50.55,69.85 180 bottom
R3  41.66,74.93 90 bottom
R5  63.25,74.93 90 bottom
R6  73.41,73.66 0 bottom
R7  73.41,71.63 180 bottom
R9  86.11,76.71 0 bottom
R10  92.46,72.39 0 bottom
R11  92.46,69.85 180 bottom
R13  105.16,74.93 90 bottom
R14  114.05,72.39 0 bottom
R15  114.05,69.85 180 bottom
R17  129.29,73.66 90 bottom
R18  138.18,72.39 0 bottom
R19  138.18,69.85 180 bottom
R26  42.93,72.39 180 bottom
R27  64.52,72.39 180 bottom
R28  86.11,72.39 180 bottom
R29  107.7,72.39 180 bottom
R30  131.83,71.12 180 bottom
R31  86.36,87.12 90 bottom
R32  122.94,68.83 270 bottom
RF1  51.82,80.01 270 bottom
RF2  54.36,76.2 270 bottom
RF3  73.41,80.01 270 bottom
RF4  75.95,76.2 270 bottom
RF5  93.73,80.01 270 bottom
RF6  96.27,76.2 270 bottom
RF7  115.32,80.01 270 bottom
RF8  117.86,76.2 270 bottom
RF9  139.45,80.01 270 bottom
RF10  141.99,76.2 270 bottom
RS1  54.36,80.01 270 bottom
RS2  75.95,80.01 270 bottom
RS3  96.27,80.01 270 bottom
RS4  117.86,80.01 270 bottom
RS5  141.99,80.01 270 bottom
U$1  124.21,12.7 0 top
U$2  115.32,21.59 180 top
U$3  103.89,12.7 0 top
U$4  95,21.59 180 top
U$5  69.6,77.47 270 bottom
U$6  61.98,15.24 90 top
U$7  50.55,7.62 270 top
U$11  17.53,7.62 270 top
U$12  26.42,16.51 90 top
U$13  17.53,27.94 270 top
U$14  26.42,36.83 90 top
U$15  48.01,77.47 270 bottom
U$16  17.53,48.26 270 top
U$17  26.42,57.15 90 top
U$18  17.53,68.58 270 top
U$19  26.42,77.47 90 top
U$21  124.21,46.99 0 top
U$22  115.32,55.88 180 top
U$23  103.89,46.99 0 top
U$24  95,55.88 180 top
U$25  89.92,77.47 270 bottom
U$26  83.57,24.13 0 top
U$27  77.22,40.64 180 top
U$28  74.68,62.23 90 top
U$29  55.63,57.15 270 top
U$33  139.45,86.36 90 top
U$34  130.56,77.47 270 top
U$35  111.51,77.47 270 bottom
U$36  106.43,86.36 90 top
U$37  97.54,77.47 270 top
U$38  60.71,86.36 90 top
U$39  51.82,77.47 270 top
U$41  164.85,46.99 0 top
U$42  155.96,55.88 180 top
U$43  144.53,46.99 0 top
U$44  135.64,55.88 180 top
U$45  135.64,77.47 270 bottom
U$46  135.64,21.59 180 top
U$47  144.53,12.7 0 top
U$48  155.96,21.59 180 top
U$49  164.85,12.7 0 top

### Tracks (layer width: path | path; a pad name or v marks a point on that pad's centre or on a via)
CELL1
  Bottom 1.016: RF2.1 RS1.2
  Bottom 1.27: RF2.1 55.28,77.05 56.9,75.44 56.9,73.15 | 56.9,73.15 56.9,72.39 | 56.9,72.39 D6.A 56.9,71.63 56.13,72.39 | R1.1 56.13,72.39 | 56.13,72.39 56.9,72.39 | 56.13,72.39 56.9,73.15
CELL2
  Bottom 0.61: R6.1 74.68,73.66 75.95,72.39 78.49,72.39
  Bottom 1.016: RS2.2 RF4.1
  Bottom 1.27: RF4.1 77.38,77.05 78.49,75.95 78.49,72.39 D7.A
CELL3
  Bottom 1.016: RS3.2 RF6.1
  Bottom 1.27: RF6.1 97.7,77.05 98.81,75.95 98.81,73.41 | 98.81,73.41 98.81,72.39 | 98.81,72.39 D8.A 98.81,71.63 98.55,71.63 97.79,72.39 | R10.1 97.79,72.39 | 97.79,72.39 98.81,72.39 | 97.79,72.39 98.81,73.41
CELL4
  Bottom 1.016: RS4.2 RF8.1
  Bottom 1.27: RF8.1 119.04,77.05 120.4,75.69 120.4,73.41 | 120.4,73.41 120.4,72.39 | 120.4,72.39 D9.A 120.4,71.63 120.14,71.63 119.38,72.39 | R14.1 119.38,72.39 | 119.38,72.39 120.4,72.39 | 119.38,72.39 120.4,73.41
CELL5
  Bottom 1.016: RS5.2 RF10.1
  Bottom 1.27: RF10.1 142.91,77.05 144.53,75.44 144.53,73.41 | 144.53,73.41 144.53,72.9 | 144.53,72.39 144.53,71.88 | 144.53,71.88 D10.A | R18.1 143.51,72.39 | 143.51,72.39 144.02,72.39 | 144.02,72.39 144.53,72.39 | 144.02,72.39 144.53,72.9 | 144.53,72.9 144.53,72.39 | 144.53,71.88 144.02,71.88 143.51,72.39 | 143.51,72.39 144.53,73.41
GND  (via drill 0.38, 0.6)
  Top 0.406: U$6.P$2 62.99,20.83 v62.74,20.57
  Bottom 0.305: U$15.2 47.68,81.1 47.24,81.53 46.74,81.53 45.21,80.01 44.96,80.01 44.7,79.76 44.7,76.45 44.2,75.95 C4.2 | U$5.2 69.27,81.1 68.58,81.79 68.07,81.79 66.29,80.01 CIN4.2 | 88.39,81.53 89.15,81.53 89.59,81.1 U$25.2 89.59,78.42 88.65,77.47 88.65,75.86 C6.2 | U$35.2 111.18,81.1 110.74,81.53 110.24,81.53 108.71,80.01 CIN8.2 | U$45.2 135.31,81.1 134.87,81.53 134.11,81.53 132.84,80.26 132.08,80.26 131.96,80.14 CIN10.2 CIN9.2 131.83,77.6 C10.2
  Bottom 0.406: CIN1.2 CIN2.2 | CIN4.2 CIN3.2 | v62.74,20.57 62.74,13.21 63.25,12.7 63.25,7.62 76.2,7.62 v76.45,6.6
  other vias: 150.11,43.69 38.35,42.67 38.1,22.1 2.79,21.34 3.56,41.91 16,62.99 107.7,70.1 109.47,43.69 109.73,24.38 109.73,58.93 120.14,91.95 140.72,69.85 151.38,70.36 150.37,59.18 150.11,24.89 150.11,34.29 150.11,8.89 150.11,1.52 171.2,10.16 109.47,8.64 81.03,6.6 63.75,1.78 89.15,21.84 89.41,34.29 109.47,54.61 52.83,51.56 109.47,14.22 130.05,34.29 130.05,25.15 130.05,59.44 171.45,73.41 171.2,55.88 171.2,64.77 39.88,71.63 37.34,91.95 55.12,91.95 62.99,91.95 69.6,51.56 81.03,3.05 16.76,1.78 23.37,1.78 2.54,2.29 2.79,11.43 2.79,25.91 2.54,37.59 16.51,42.67 3.3,49.02 3.3,56.64 3.3,65.28 19.05,62.99 38.35,62.99 39.88,70.1 88.9,59.18 88.9,44.45 109.73,20.32 130.05,10.92 129.79,45.21 130.05,53.34 150.37,53.59 150.11,46.23 171.2,44.45 171.2,26.67 171.2,17.78 109.47,52.58 105.16,91.95 116.59,70.61 105.16,70.1 96.27,70.61 95,69.34 85.34,70.61 87.38,70.61 73.41,91.95 99.31,91.95 75.95,85.85 171.45,90.93 161.04,69.85 148.34,70.36 150.11,20.57 109.47,46.23 89.15,53.09 29.97,2.03 2.79,16.51 14.99,22.1 3.05,69.85 75.95,3.05 38.86,46.48 109.73,34.29 151.13,91.95 128.02,91.95 92.46,91.95 135.38,91.95 67.31,70.87 66.04,69.09 87.38,67.06 171.45,79.76 142.75,69.85 58.17,51.56 48.77,67.06 50.55,67.06 129.03,68.83 130.05,67.56 82.3,85.6 82.3,83.06
  pour Top (isolate 1.016): -9.14,97.79 -9.14,-6.35 178.82,-6.35 183.9,99.06
  pour Bottom (isolate 0.406): -9.14,104.14 -9.14,-6.35 180.09,-10.16 180.09,100.33
N$3  (via drill 0.6)  (1 unrouted)
  Top 0.203: U$13.P$8 U$13.P$15 U$13.P$3 U$13.P$4 | U$13.P$5 U$13.P$4 | U$14.P$16 U$14.P$13 | U$13.P$14 U$13.P$7 U$13.P$6 | U$13.P$14 U$13.P$12 | U$13.P$14 U$13.P$4 | U$11.P$8 U$11.P$15 U$11.P$3 U$11.P$4 | U$11.P$5 U$11.P$4 | U$12.P$16 U$12.P$13 | U$11.P$14 U$11.P$7 U$11.P$6 | U$11.P$14 U$11.P$12 | U$11.P$14 U$11.P$4 | U$11.P$13 U$11.P$16 | U$12.P$12 U$12.P$5 U$12.P$4 | U$12.P$12 U$12.P$14 | U$12.P$12 U$12.P$6 U$12.P$7 30.23,18.03 U$12.P$8 U$12.P$15 U$12.P$3 | U$17.P$3 U$17.P$15 U$17.P$8 | U$17.P$7 U$17.P$6 U$17.P$12 | U$17.P$12 U$17.P$5 U$17.P$4 | U$17.P$12 U$17.P$14 | U$14.P$12 U$14.P$5 U$14.P$4 | U$14.P$12 U$14.P$14 | U$14.P$12 U$14.P$6 U$14.P$7 U$14.P$8 U$14.P$15 U$14.P$3 | U$11.P$9 U$11.P$11 | U$16.P$5 U$16.P$4 U$16.P$14 U$16.P$12 U$16.P$15 U$16.P$3 | U$17.P$16 U$17.P$13 | U$16.P$13 U$16.P$16 | U$13.P$13 U$13.P$16 | U$12.P$9 U$12.P$11 | U$14.P$9 U$14.P$11 | U$16.P$8 U$16.P$6 U$16.P$7 | U$16.P$10 20.07,49.02 U$16.P$1 20.07,47.5 U$16.P$9 | U$13.P$10 20.07,28.7 U$13.P$1 20.07,27.18 U$13.P$9 | U$11.P$10 20.07,8.38 U$11.P$1 | U$17.P$9 U$17.P$11
  Top 0.305: 30.23,55.12 32.77,55.12 U$17.P$14
  Top 1.27: 9.91,53.34 U$16.P$12 U$16.P$6 U$16.P$1 | 28.96,78.74 v28.96,85.6 v31.75,85.6 v33.27,85.6 v35.05,85.6 | 28.96,78.74 28.96,77.47 U$19.P$2 | U$11.P$11 U$11.P$13 30.23,16.51 | 30.23,28.19 U$13.P$13 30.23,18.03 30.23,16.51 | 30.23,28.19 U$14.P$7 | U$14.P$7 U$16.P$13 | U$16.P$13 30.23,55.12 30.23,57.15 | 30.23,68.58 U$17.P$8 30.23,57.15 | 30.23,68.58 28.96,78.74 | U$18.P$2 30.23,68.58 | U$17.P$1 30.23,57.15 | U$16.P$13 U$16.P$11 U$16.P$9 | U$14.P$7 U$14.P$10 25.15,34.29 U$14.P$1 25.15,39.37 U$14.P$9 | U$12.P$1 30.23,16.51 | U$12.P$9 25.15,19.05 U$12.P$1 | U$12.P$10 25.15,13.97 U$12.P$1 | U$11.P$9 18.8,5.08 U$11.P$1 | U$13.P$9 U$13.P$11 | U$13.P$10 20.83,30.48 20.83,28.19 30.23,28.19 | U$17.P$10 25.15,54.61 U$17.P$1 | U$17.P$9 25.15,59.69 U$17.P$1
  Top 1.778: U$11.P$8 U$11.P$9 | U$12.P$13 U$12.P$11 | U$13.P$8 16.26,25.4 U$13.P$1
  Top 1.93: U$14.P$13 U$14.P$11 | U$17.P$16 U$17.P$11
  Bottom 0.305: 41.66,76.07 R3.2 | R26.1 41.4,72.39 40.13,73.66 40.13,75.44 40.39,75.69 41.57,75.69 R3.2 | CIN2.1 43.06,77.18 R3.2
  Bottom 0.813: CIN2.1 43.06,80.47 L1.1
  Bottom 1.27: v28.96,85.6 45.14,85.6 L1.1
N$4  (via drill 0.6)
  Top 0.305: v84.58,87.88 80.26,87.88 79.76,87.38 J2.1
  Bottom 0.305: Q6.1 88.47,87.38 87.38,87.38 86.78,87.97 R31.2 86.27,87.88 v84.58,87.88
N$5  (via drill 0.6)
  Top 0.203: U$7.P$5 U$7.P$12 U$7.P$6 U$7.P$7 U$7.P$14 U$7.P$4 U$7.P$3 U$7.P$15 U$7.P$8 U$7.P$9 | U$4.P$8 U$4.P$15 U$4.P$3 U$4.P$4 U$4.P$14 U$4.P$7 U$4.P$6 U$4.P$12 U$4.P$5 | U$2.P$6 U$2.P$7 U$2.P$14 U$2.P$4 U$2.P$3 U$2.P$15 U$2.P$8 U$2.P$9 | U$2.P$12 U$2.P$5 | U$1.P$5 U$1.P$4 U$1.P$14 U$1.P$12 | U$1.P$3 U$1.P$15 U$1.P$8 | U$6.P$16 U$6.P$13 U$6.P$11 U$6.P$9 | U$1.P$16 U$1.P$13 U$1.P$11 126.75,18.54 U$1.P$9 | U$3.P$12 U$3.P$6 | U$6.P$15 U$6.P$8 | U$6.P$7 U$6.P$6 U$6.P$12 | U$3.P$11 106.43,24.64 U$3.P$13
  Top 1.016: U$2.P$12 U$2.P$6 | U$2.P$1 114.05,19.05 U$2.P$9 U$2.P$11
  Top 1.27: U$3.P$14 U$3.P$12 | v61.85,72.51 58.93,69.6 43.94,69.6 41.15,66.8 41.15,19.56 42.93,17.78 U$6.P$16 U$7.P$6 | 102.36,17.53 97.28,17.53 97.28,19.05 U$4.P$10 95,19.05 | 102.36,17.53 114.55,17.53 | 114.55,17.53 115.06,17.53 | 115.06,17.53 116.59,17.53 | 116.59,17.53 126.75,17.53 126.75,18.54 | U$2.P$10 116.59,19.05 | 116.59,19.05 116.59,17.53 | U$4.P$13 U$4.P$11 | U$4.P$8 95,25.4 U$4.P$1 95,19.05 | 95,19.05 U$4.P$9 93.73,17.78 93.73,10.16 U$6.P$5 U$6.P$4 | U$3.P$9 103.63,15.24 103.63,13.46 | 103.63,13.46 103.89,13.46 U$3.P$1 103.89,15.24 U$3.P$10 102.36,15.24 102.36,17.53 | U$3.P$7 103.63,8.89 103.63,13.46 | U$2.P$1 116.59,20.32 116.59,19.05 | U$1.P$8 125.22,8.89 125.22,13.97 | U$2.P$13 114.55,8.89 114.55,17.53 | U$2.P$16 115.06,6.35 115.06,17.53 | U$7.P$13 U$7.P$11 | U$6.P$10 59.44,13.97 U$6.P$1 | U$7.P$10 53.09,8.89 U$7.P$1 53.09,6.35 U$7.P$9 | U$7.P$16 U$6.P$6 | U$6.P$4 U$6.P$3 | U$6.P$14 U$6.P$4
  Top 1.778: U$3.P$16 106.43,24.64 | U$3.P$11 U$3.P$9 | U$3.P$7 U$3.P$14 U$3.P$4 U$3.P$3 U$3.P$15 U$3.P$8 | U$3.P$5 U$3.P$12 | U$1.P$12 U$1.P$6 | U$1.P$7 U$1.P$14 | U$1.P$4 U$1.P$3 | U$1.P$10 122.94,15.24 U$1.P$1 125.22,13.97 125.48,13.97 U$1.P$9 | U$4.P$9 U$4.P$11 | U$4.P$13 U$4.P$16 | U$6.P$15 U$6.P$3 | U$6.P$12 U$6.P$14 | U$7.P$9 U$7.P$11 | U$7.P$13 U$7.P$16 | U$6.P$10 U$6.P$9
  Bottom 0.305: R27.1 61.97,72.39 v61.85,72.51 | R5.2 62.01,75.78 61.85,75.95
  Bottom 1.27: L2.1 63.25,82.55 61.85,81.15 CIN4.1 CIN3.1 61.85,75.95 v61.85,72.51 v59.81,70.48 v60.83,71.5
N$6
  Bottom 0.305: U$5.1 68.62,79.8 67.56,78.74 67.56,74.93 66.71,74.08 C3.1 R5.1
N$7
  Bottom 0.305: R6.2 R7.1
  Bottom 0.406: R6.2 70.61,72.39 | 70.61,72.39 70.02,72.39 C1.1 | U$5.5 70.57,72.43 70.61,72.39
N$8
  Bottom 0.305: CF2.1 RF3.2 73.24,78.99 71.37,78.99 69.27,76.89 U$5.7
N$9
  Bottom 0.305: RF4.2 CF2.2 73.24,75.35 72.64,75.95 70.36,75.95 69.92,75.51 U$5.6
N$10
  Bottom 0.254: 70.87,80.52 70.69,80.52 U$5.4
  Bottom 0.305: U$5.4 70.74,80.39 70.87,80.52
  Bottom 0.61: D2.C 70.87,87.24 70.87,86.36 73.28,83.95 COUT2.1
  Bottom 1.016: RF3.1 73.41,83.69 COUT2.1 | RF3.1 RS2.1 | RF3.1 71.21,80.86 70.87,80.52
N$11
  Bottom 0.305: R1.2 R2.1
  Bottom 0.406: R1.2 49.02,72.39 | 49.02,72.39 48.43,72.39 C2.1 | U$15.5 48.98,72.43 49.02,72.39
N$12
  Bottom 0.305: CF1.1 RF1.2 51.65,78.99 49.78,78.99 47.68,76.89 U$15.7
N$13
  Bottom 0.305: RF2.2 CF1.2 51.65,75.35 51.05,75.95 48.77,75.95 48.33,75.51 U$15.6
N$14
  Bottom 0.254: 49.28,80.52 49.1,80.52 U$15.4
  Bottom 0.305: U$15.4 49.15,80.39 49.28,80.52
  Bottom 1.016: RF1.1 51.82,83.69 COUT1.1 51.69,86.88 D1.C | RF1.1 RS1.1 | RF1.1 49.62,80.86 49.28,80.52
N$15
  Bottom 0.305: U$15.3 48.33,81.72 arc90 48.26,81.79
  Bottom 1.016: 48.26,81.79 48.26,82.55 L1.2
N$16
  Bottom 0.305: U$5.3 69.92,81.72 arc90 69.85,81.79
  Bottom 1.016: 69.85,81.79 69.85,82.63 L2.2
N$18  (via drill 0.6)  (3 unrouted)
  Top 0.203: U$29.P$13 U$29.P$16 | U$28.P$4 U$28.P$14 U$28.P$7 | U$28.P$5 U$28.P$12 U$28.P$6 | U$27.P$13 U$27.P$16 | U$26.P$7 U$26.P$14 U$26.P$4 U$26.P$5 U$26.P$12 U$26.P$6 | U$24.P$13 U$24.P$16 | U$23.P$7 U$23.P$14 U$23.P$4 U$23.P$5 U$23.P$12 U$23.P$6 | U$29.P$8 U$29.P$15 U$29.P$3 U$29.P$4 U$29.P$14 U$29.P$7 U$29.P$6 U$29.P$12 U$29.P$5 | U$27.P$8 U$27.P$15 U$27.P$3 U$27.P$4 U$27.P$14 U$27.P$7 U$27.P$6 U$27.P$12 | U$24.P$8 U$24.P$15 U$24.P$3 U$24.P$4 U$24.P$14 U$24.P$7 | U$24.P$6 U$24.P$12 U$24.P$5 | U$22.P$5 U$22.P$12 U$22.P$6 U$22.P$7 U$22.P$14 U$22.P$4 U$22.P$3 U$22.P$15 U$22.P$8 114.55,57.91 114.55,55.37 U$22.P$1 115.57,53.34 U$22.P$10 | U$28.P$3 U$28.P$15 U$28.P$8 | U$26.P$3 U$26.P$15 U$26.P$8 | U$23.P$3 U$23.P$15 U$23.P$8 | U$28.P$16 U$28.P$13 U$28.P$11 | U$26.P$16 U$26.P$13 U$26.P$11 U$26.P$9 | U$23.P$16 U$23.P$13 | U$21.P$16 U$21.P$13 U$21.P$11 U$21.P$9 | U$21.P$3 U$21.P$15 U$21.P$8 | U$21.P$12 U$21.P$6 | U$23.P$10 102.87,48.01 U$23.P$1 104.14,49.02 104.14,49.53 U$23.P$9 | U$24.P$10 95.76,53.34 95.76,54.36 U$24.P$1 | 70.36,54.36 70.36,53.34
  Top 0.406: U$28.P$10 U$28.P$7
  Top 1.016: U$23.P$11 U$23.P$9 | U$24.P$7 U$24.P$6 | U$21.P$12 121.16,40.64 121.67,40.13 121.67,40.39 | U$21.P$9 125.48,49.53 U$21.P$1
  Top 1.27: 74.42,63.5 73.9,62.91 | 73.9,62.91 70.87,59.44 67.06,59.44 70.87,55.63 U$29.P$16 | U$21.P$7 U$21.P$10 121.67,48.26 U$21.P$1 | U$22.P$10 116.84,53.34 116.84,49.53 | U$22.P$9 U$22.P$11 | 114.55,55.37 112.52,55.37 112.52,53.34 | U$23.P$11 106.68,53.34 106.68,49.53 | U$23.P$7 102.87,43.18 | 102.87,43.18 102.87,48.01 | U$23.P$8 102.87,43.18 | U$22.P$16 U$22.P$13 113.28,43.18 113.28,49.53 | U$21.P$6 U$21.P$7 | U$21.P$7 U$21.P$8 | U$21.P$14 U$21.P$7 | U$21.P$12 U$21.P$14 | U$21.P$14 121.67,40.39 U$21.P$4 U$21.P$5 | U$21.P$5 118.62,38.1 118.62,37.85 119.13,37.85 U$21.P$5 | U$24.P$13 92.96,43.18 92.96,49.53 | U$24.P$11 U$24.P$9 95,53.34 U$24.P$1 | U$24.P$7 95.76,59.69 95.76,54.36 | U$27.P$13 U$27.P$11 U$27.P$9 U$27.P$10 78.49,38.1 U$27.P$1 77.47,39.62 77.47,48.01 78.23,48.01 U$27.P$4 | U$28.P$8 U$28.P$9 | U$28.P$7 U$28.P$6 | U$29.P$8 49.28,58.42 U$29.P$1 58.17,58.42 U$29.P$10 U$29.P$9 U$29.P$16 | U$29.P$11 U$29.P$13 | v82.3,70.36 78.99,70.36 74.68,66.04 74.68,63.5 74.5,63.5 73.9,62.91 | U$27.P$14 79.76,48.26 73.41,54.61 U$29.P$16 | U$24.P$16 89.92,40.64 U$26.P$16 | U$26.P$10 81.03,25.4 | 81.03,25.4 U$26.P$8 U$26.P$7 | 81.03,25.4 84.84,25.4 U$26.P$9 | U$27.P$5 U$27.P$12 | U$29.P$16 70.61,54.61 70.36,54.36
  Top 1.778: U$23.P$13 U$23.P$11 | U$28.P$11 U$28.P$9 U$28.P$10 | U$21.P$10 116.84,49.53 113.28,49.53 U$22.P$11 106.68,49.53 92.96,49.53 U$24.P$11 | U$26.P$10 U$27.P$11
  Bottom 0.305: R28.1 83.06,72.39 | 82.8,72.39 82.67,72.39 82.36,72.07 | 82.36,72.07 82.17,71.88 | 83.06,72.39 82.8,72.39 | 82.8,72.39 82.55,72.14 82.8,72.14 | 82.8,72.14 83.06,72.39 | 83.06,72.39 82.55,72.9 82.55,71.88 82.8,72.14 | v82.3,70.36 82.36,72.07
  Bottom 1.016: L3.1 86.11,82.55 85.47,81.92 CIN6.1 CIN5.1 85.26,78.27 R9.2 82.55,74 82.55,72.9
  Bottom 1.27: 82.17,72.27 82.3,72.39 v82.3,70.36
N$19
  Bottom 0.305: U$25.1 88.94,79.8 86.96,77.81 R9.1 86.96,75.78 86.61,75.44 85.6,75.44 85.34,75.18 85.34,74.26 C6.1
N$20
  Bottom 0.305: R10.2 R11.1
  Bottom 0.406: R10.2 90.93,72.39 | 90.93,72.39 90.34,72.39 C5.1 | U$25.5 90.89,72.43 90.93,72.39
N$21
  Bottom 0.305: CF3.1 RF5.2 93.56,78.99 91.69,78.99 89.59,76.89 U$25.7
N$22
  Bottom 0.305: RF6.2 CF3.2 93.56,75.35 92.96,75.95 90.68,75.95 90.24,75.51 U$25.6
N$23
  Bottom 0.254: 91.19,80.52 91.01,80.52 U$25.4
  Bottom 0.305: U$25.4 91.06,80.39 91.19,80.52
  Bottom 1.016: RF5.1 93.73,83.69 COUT3.1 93.6,86.88 D3.C | RF5.1 RS3.1 | RF5.1 91.53,80.86 91.19,80.52
N$24
  Bottom 0.305: U$25.3 90.24,81.72 arc90 90.17,81.79
  Bottom 1.016: 90.17,81.79 90.17,82.63 L3.2
N$26  (via drill 0.6)  (1 unrouted)
  Top 0.305: 105.16,82.55 104.52,83.19 104.34,83.36
  Top 1.27: U$33.P$2 U$34.P$2 126.75,82.55 105.16,82.55 | U$37.P$2 95,80.01 97.39,81.51 97.54,81.65 97.54,86.36 96.27,87.63 88.65,87.63 86.11,90.17 75.95,90.17 72.14,86.36 U$38.P$2 U$39.P$2 | 102.11,77.47 103.76,75.82 v103.76,72.51 | U$36.P$2 104.52,85.72 104.52,83.19
  Top 1.778: 102.11,77.47 U$37.P$2
  Bottom 0.406: v103.76,72.51 103.88,72.39 R29.1
  Bottom 0.61: R13.2 104.99,75.95 103.76,75.95
  Bottom 1.016: CIN7.1 103.76,75.95 v103.76,72.51
  Bottom 1.27: CIN7.1 CIN8.1 103.76,81.15 105.16,82.55 L4.1
N$27
  Bottom 0.305: U$35.1 110.53,79.8 109.47,78.74 109.47,74.93 108.62,74.08 C8.1 R13.1
N$28
  Bottom 0.305: R14.2 R15.1
  Bottom 0.406: R14.2 112.52,72.39 | 112.52,72.39 111.93,72.39 C7.1 | U$35.5 112.48,72.43 112.52,72.39
N$29
  Bottom 0.305: CF4.1 RF7.2 115.15,78.99 113.28,78.99 111.18,76.89 U$35.7
N$30
  Bottom 0.305: RF8.2 CF4.2 115.15,75.35 114.55,75.95 112.27,75.95 111.83,75.51 U$35.6
N$31
  Bottom 0.254: 112.78,80.52 112.6,80.52 U$35.4
  Bottom 0.305: U$35.4 112.65,80.39 112.78,80.52
  Bottom 1.016: RF7.1 115.32,83.69 COUT4.1 115.19,86.88 D4.C | RF7.1 RS4.1 | RF7.1 113.12,80.86 112.78,80.52
N$32
  Bottom 0.305: U$35.3 111.83,81.72 arc90 111.76,81.79
  Bottom 1.016: 111.76,81.79 111.76,82.47 L4.2
N$34  (via drill 0.6)
  Top 0.203: U$47.P$15 U$47.P$8 144.53,8.89 | U$46.P$13 U$46.P$16 | U$47.P$12 U$47.P$5 U$47.P$4 U$47.P$14 U$47.P$7 144.53,8.89 | U$41.P$3 U$41.P$15 U$41.P$8 162.31,41.91 | U$42.P$13 U$42.P$16 | U$41.P$5 160.27,38.1 U$41.P$4 U$41.P$14 U$41.P$7 162.31,41.91 | U$41.P$12 U$41.P$6 | U$49.P$3 U$49.P$15 U$49.P$8 164.85,8.89 | U$48.P$13 U$48.P$16 | U$49.P$6 U$49.P$12 U$49.P$5 U$49.P$4 U$49.P$14 U$49.P$7 164.85,8.89 | U$44.P$8 U$44.P$15 U$44.P$3 U$44.P$4 | U$44.P$5 U$44.P$12 U$44.P$6 U$44.P$7 U$44.P$14 U$44.P$4 | U$44.P$4 140.97,59.69 | U$42.P$8 U$42.P$15 U$42.P$3 U$42.P$4 U$42.P$14 U$42.P$7 | U$42.P$7 U$42.P$6 U$42.P$12 U$42.P$5 | U$46.P$7 U$46.P$6 U$46.P$12 U$46.P$5 | U$43.P$7 U$43.P$14 U$43.P$4 U$43.P$5 U$43.P$12 | U$48.P$7 U$48.P$6 U$48.P$12 U$48.P$5 | U$48.P$7 U$48.P$14 U$48.P$4 U$48.P$3 U$48.P$15 U$48.P$8 | U$43.P$3 U$43.P$15 U$43.P$8 144.53,46.99 U$43.P$9 | U$46.P$9 U$46.P$11 | 153.42,18.54 U$48.P$11 | U$43.P$16 U$43.P$13 U$43.P$11 | U$41.P$16 U$41.P$13 | U$47.P$16 U$47.P$13 U$47.P$11 | U$49.P$16 U$49.P$13 U$49.P$11 167.39,16.51 | 162.81,14.22 163.83,14.22 | 162.81,14.22 U$49.P$1 | U$49.P$9 167.39,16.51 | U$41.P$11 U$41.P$9 163.83,47.24 162.81,45.97 163.64,46.9 U$41.P$1 162.31,41.91 | U$42.P$10 156.59,52.7 | U$46.P$3 U$46.P$4 | 132.59,52.07 U$44.P$9 | 132.59,52.07 U$44.P$1 136.4,55.12 U$44.P$10 | 155.96,53.34 U$42.P$7 | U$42.P$9 155.45,53.34 U$42.P$1 | U$43.P$10 144.02,47.5 U$43.P$1 | 132.59,52.07 132.59,50.04 U$44.P$11 U$44.P$13 | U$48.P$10 156.21,19.05 156.21,19.3 U$48.P$1 | 153.42,18.54 154.94,18.54 U$48.P$1 | 153.42,18.54 U$48.P$9 | U$49.P$10 162.81,14.73 162.81,14.22 | 167.39,16.51 U$49.P$1 | U$48.P$7 156.21,23.11 156.21,20.83 U$48.P$1
  Top 0.203: U$49.P$1 164.85,8.89 | U$46.P$10 135.64,19.05 U$46.P$1 | 144.53,15.24 U$47.P$10 | U$47.P$9 144.53,15.24 | 144.53,15.24 U$47.P$1 144.53,8.89
  Top 1.27: U$43.P$1 144.53,46.99 147.07,46.99 | U$42.P$1 155.96,53.34 156.59,52.7 | 155.32,18.41 U$48.P$1 | v127,71.37 127,71.12 133.1,71.12 133.1,63.5 134.62,63.75 140.97,59.69 135.89,56.13 135.89,54.86 U$44.P$1
  Top 1.778: U$49.P$10 U$49.P$14 | U$49.P$14 162.31,2.03 | 154.43,12.19 154.43,5.08 153.42,6.1 U$48.P$16 | 154.43,12.19 154.43,19.05 156.21,19.05 | 154.43,12.19 147.07,12.19 | 143.51,2.03 143.51,13.97 U$47.P$1 | 147.07,12.19 U$47.P$3 U$47.P$15 | 147.07,12.19 143.51,2.03 | 143.51,2.03 133.6,2.03 133.6,19.05 135.64,19.05 | U$46.P$9 U$46.P$8 | 135.89,56.13 138.18,56.13 135.64,56.39 135.64,64.01 U$44.P$13 U$44.P$16 U$46.P$3 U$46.P$15 U$46.P$8 | U$42.P$10 158.5,57.15 | 166.62,65.02 166.62,66.55 158.5,66.55 158.5,57.15 | 166.62,65.02 166.62,46.9 163.64,46.9 | U$41.P$10 162.31,48.77 163.83,47.24 | U$41.P$12 159.77,38.61 160.27,38.1 | U$47.P$6 139.45,6.86 139.95,6.35 U$47.P$12 | U$47.P$9 U$47.P$11 | U$46.P$8 133.1,23.11 136.14,20.07 135.89,20.07 U$46.P$1 | U$46.P$14 U$46.P$4 U$46.P$5 | U$43.P$12 U$43.P$6 | U$43.P$11 U$43.P$9 | U$42.P$9 153.42,50.04 153.67,49.78 | 153.67,49.78 153.92,49.53 U$42.P$11 | U$42.P$16 153.42,42.93 153.67,43.18 153.67,49.78 | U$41.P$16 167.39,64.26 166.62,65.02 | 158.5,57.15 150.88,49.53 U$43.P$10 U$44.P$10 | 154.43,12.19 156.46,12.19 U$49.P$14
  Top 1.93: U$43.P$6 U$43.P$8 | U$46.P$13 U$46.P$9
  Bottom 0.305: CIN9.1 129.29,77.34 R17.2
  Bottom 1.016: CIN9.1 CIN10.1 129.16,81.15 130.56,82.55 L5.1
  Bottom 1.27: CIN9.1 129.03,77.47 127,75.44 v127,71.37 127,71.12 v129.54,71.12 R30.1
N$35
  Bottom 0.305: R17.1 C10.1 133.35,74.33 133.35,75.69 134.66,77 U$45.1
N$36
  Bottom 0.406: 136.65,72.39 R18.2 R19.1 | 136.65,72.39 136.06,72.39 C9.1 | U$45.5 136.61,72.43 136.65,72.39
N$37
  Bottom 0.305: U$45.7 135.31,76.64 137.67,78.99 139.28,78.99 RF9.2 CF5.1
N$38
  Bottom 0.305: U$45.6 135.96,75.51 136.65,76.2 138.6,76.2 CF5.2 RF10.2
N$39
  Bottom 0.305: U$45.4 136.78,80.39 136.91,80.52
  Bottom 1.016: RF9.1 139.45,83.69 COUT5.1 139.32,86.88 D5.C | RF9.1 RS5.1 | RF9.1 137.25,80.86 136.91,80.52
N$40
  Bottom 0.305: U$45.3 135.96,81.46 135.89,81.79
  Bottom 1.016: 135.89,81.79 135.89,82.63 L5.2
N$43
  Bottom 0.305: U$15.1 47.03,79.8 45.97,78.74 45.97,74.93 45.12,74.08 C4.1 R3.1
POUT  (via drill 0.6)
  Top 2.184: J1.1 78.99,73.41 v73.41,67.82
  Bottom 0.305: J1.1 78.99,79.5 | R32.2 122.94,66.04
  Bottom 0.813: D7.C 77.86,67.95 75.95,66.04
  Bottom 1.016: D10.C 144.53,66.04 | 122.94,66.04 122.31,66.04 D9.C | D8.C 100.71,67.95 103.89,64.77
  Bottom 1.27: 123.95,58.17 124.21,58.17 125.73,56.64 | D6.C 56.9,66.04 54.36,63.5 54.36,59.69 56.9,57.15 73.41,57.15 75.56,54.99 75.95,54.61
  Bottom 1.676: 125.73,56.64 142.75,56.64 144.53,58.42 144.53,66.04 | 75.95,54.61 75.95,66.04 74.17,67.82 v73.41,67.82 v74.68,69.09 | 102.36,56.64 88.14,56.64 85.6,54.1 76.45,54.1 75.56,54.99 | 123.95,58.17 123.95,65.02 122.94,66.04 | 103.89,64.77 103.89,58.17
  Bottom 1.778: 103.89,56.64 105.41,56.64 | 105.41,56.64 122.43,56.64 | 122.43,56.64 125.73,56.64 | 123.95,58.17 122.43,56.64 | 103.89,58.17 103.89,56.64 | 103.89,58.17 102.36,56.64 103.89,56.64 | 105.41,56.64 103.89,58.17
XCTRL  (1 unrouted)
  Bottom 0.305: U$15.8 47.03,72.69 | 47.03,72.69 47.03,72.14 | 47.03,72.14 47.03,67.52 | R26.2 46.74,72.39 | 46.74,72.39 46.78,72.39 47.03,72.14 | 47.03,72.69 46.74,72.39 | U$5.8 68.62,72.39 R27.2 65.53,72.22 65.53,71.37 62.74,68.58 | U$25.8 88.94,72.39 | 88.94,72.39 88.94,69.09 | 88.94,69.09 88.94,67.69 89.15,67.48 95.67,67.48 97.54,69.34 100.33,69.34 | R28.2 88.94,72.39 | U$35.8 110.53,72.39 | 110.53,72.39 110.53,67.69 | 110.53,67.69 110.74,67.48 115.49,67.48 117.86,69.85 122.94,69.85 | R29.2 110.53,72.39 | U$45.8 134.66,71.12 | R30.2 134.37,71.12 | 134.37,71.12 134.66,71.12 | 134.37,71.12 134.62,71.37 134.62,70.87 134.37,71.12 | 134.66,71.12 134.66,67.35 134.62,67.31 131.83,67.31 130.56,66.04 128.02,66.04 124.21,69.85 122.94,69.85 | 110.53,67.69 110.15,67.31 102.87,67.31 100.84,69.34 100.33,69.34 | 88.94,69.09 80.01,69.09 79.5,69.6 77.47,69.6 76.71,70.36 72.14,70.36 70.1,68.83 68.58,68.83 67.06,67.31 64.01,67.31 62.74,68.58 | 62.74,68.58 59.44,68.58 58.17,69.85 55.63,69.85 50.55,64.77 48.01,64.77 46.99,65.79 46.99,67.48 | 100.33,69.34 100.33,77.22 98.81,78.74 98.81,80.77 97.54,82.04 95.25,82.04 95,82.3 95,89.15 94.49,89.66 91.19,89.66 91.02,89.49 Q6.3 | R32.1 122.94,69.85

### Text on the board
tPlace: CELL4 | Sht | Gnd | ANDESITE SENSOR NODE | Vo | BOSTON UNIVERSITY | CELL3 | CELL5 | CELL1 | CELL2
bPlace: Sht | Gnd | Vo | XCTRL | VOUT | GND | CELL1 | CELL2 | CELL2 | CELL3 | CELL4 | CELL5
tNames: Aleks Zozuls / Brent Parham / Osi Van Dessel / Brandon Ng / Shivani Bhatia / David Einhorn / Hannah Levin / Phillip Teng / Maria Kromis